# EAGLE schematic PDU_v2.1 (EAGLE 9.6.2)

## Sheet 1 of 12: PC104 Header
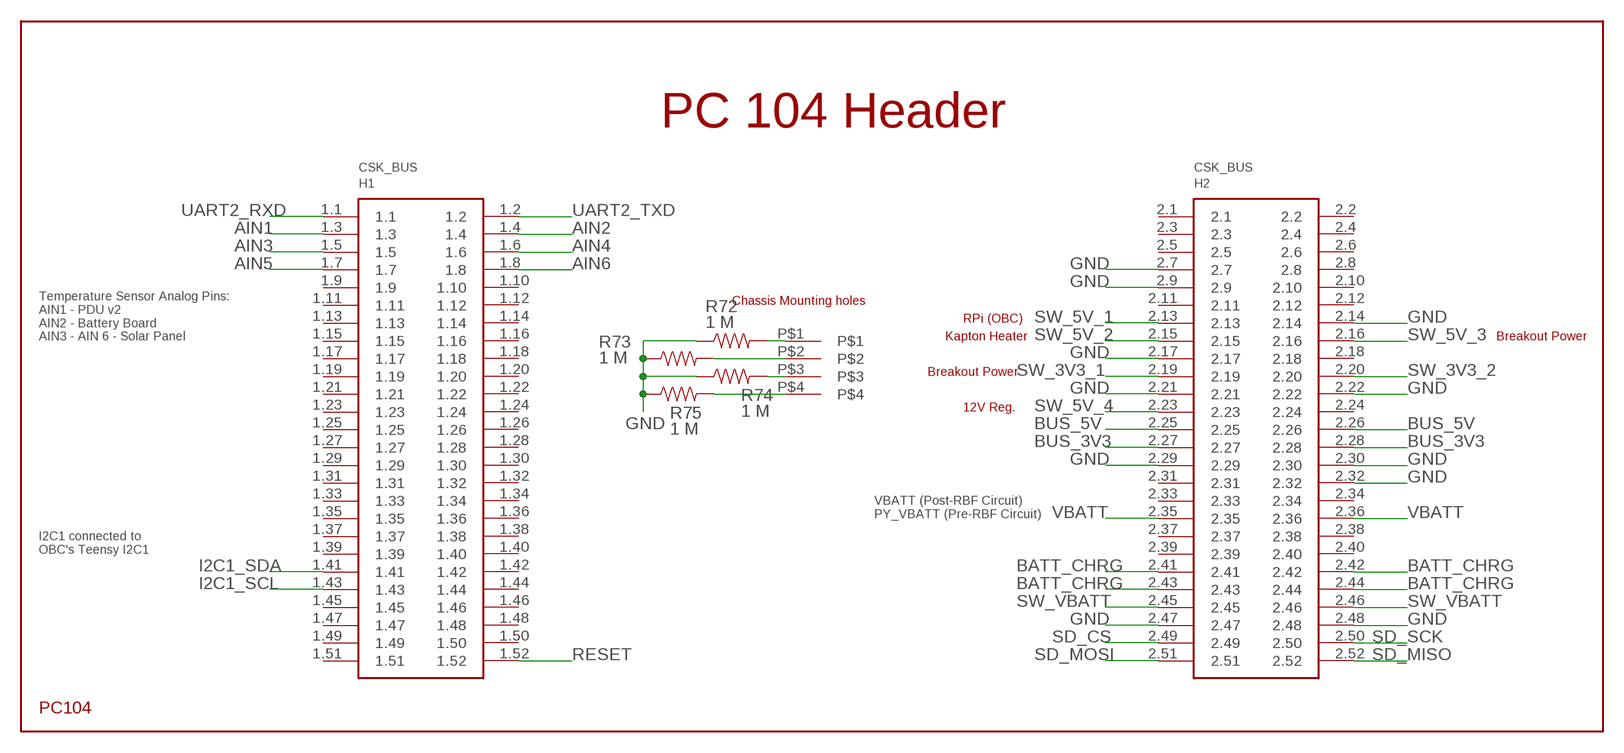
[diagram p0: schematic, sheet 1]

### Parts
H1  PC104_WCONN  [PC104_WCONN]
R72  1 M  RESISTOR0603-RES  [0603-RES]
R73  1 M  RESISTOR0603-RES  [0603-RES]
R74  1 M  RESISTOR0603-RES  [0603-RES]
R75  1 M  RESISTOR0603-RES  [0603-RES]

### Nets
AIN1: H1.1.3 ; also sheet 10
AIN2: H1.1.4 ; also sheet 2
AIN3: H1.1.5 ; also sheet 2
AIN4: H1.1.6 ; also sheet 2
AIN5: H1.1.7 ; also sheet 2
AIN6: H1.1.8 ; also sheet 2
BATT_CHRG: H1.2.41 H1.2.42 H1.2.43 H1.2.44 ; also sheet 2,11
BUS_3V3: H1.2.27 H1.2.28 ; also sheet 2,4,5,7,9,10
BUS_5V: H1.2.25 H1.2.26 ; also sheet 4,5,7,9
GND: H1.2.7 H1.2.9 H1.2.14 H1.2.17 H1.2.21 H1.2.22 H1.2.29 H1.2.30 H1.2.32 H1.2.47 H1.2.48 R72.1 R73.1 R74.1 R75.1 ; also sheet 2,3,4,5,6,7,8,9,10,11,12
I2C1_SCL: H1.1.43 ; also sheet 10
I2C1_SDA: H1.1.41 ; also sheet 10
N$59: H1.P$1 R72.2
N$64: H1.P$4 R75.2
N$67: H1.P$2 R73.2
N$71: H1.P$3 R74.2
RESET: H1.1.52 ; also sheet 2,9
SD_CS: H1.2.49 ; also sheet 2,9
SD_MISO: H1.2.52 ; also sheet 2,9
SD_MOSI: H1.2.51 ; also sheet 2,9
SD_SCK: H1.2.50 ; also sheet 2,9
SW_3V3_1: H1.2.19 ; also sheet 2,5
SW_3V3_2: H1.2.20 ; also sheet 5
SW_5V_1: H1.2.13 ; also sheet 5
SW_5V_2: H1.2.15 ; also sheet 2,5
SW_5V_3: H1.2.16 ; also sheet 2,5
SW_5V_4: H1.2.23 ; also sheet 5,6
SW_VBATT: H1.2.45 H1.2.46 ; also sheet 5
UART2_RXD: H1.1.1 ; also sheet 2,9
UART2_TXD: H1.1.2 ; also sheet 2,9
VBATT: H1.2.35 H1.2.36 ; also sheet 5,7,8,9,10,11
Unconnected: H1.1.9 H1.1.10 H1.1.11 H1.1.12 H1.1.13 H1.1.14 H1.1.15 H1.1.16 H1.1.17 H1.1.18 H1.1.19 H1.1.20 H1.1.21 H1.1.22 H1.1.23 H1.1.24 H1.1.25 H1.1.26 H1.1.27 H1.1.28 H1.1.29 H1.1.30 H1.1.31 H1.1.32 H1.1.33 H1.1.34 H1.1.35 H1.1.36 H1.1.37 H1.1.38 H1.1.39 H1.1.40 H1.1.42 H1.1.44 H1.1.45 H1.1.46 H1.1.47 H1.1.48 H1.1.49 H1.1.50 H1.1.51 H1.2.1 H1.2.2 H1.2.3 H1.2.4 H1.2.5 H1.2.6 H1.2.8 H1.2.10 H1.2.11 H1.2.12 H1.2.18 H1.2.24 H1.2.31 H1.2.33 H1.2.34 H1.2.37 H1.2.38 H1.2.39 H1.2.40

### Notes on the sheet
- PC 104 Header
- RPi (OBC)
- Temperature Sensor Analog Pins:
  AIN1 - PDU v2 
  AIN2 - Battery Board
  AIN3 - AIN 6 - Solar Panel
- Kapton Heater | Breakout Power
- Breakout Power
- 12V Reg.
- VBATT (Post-RBF Circuit)
  PY_VBATT (Pre-RBF Circuit)
- I2C1 connected to
  OBC's Teensy I2C1

## Sheet 2 of 12: Connectors
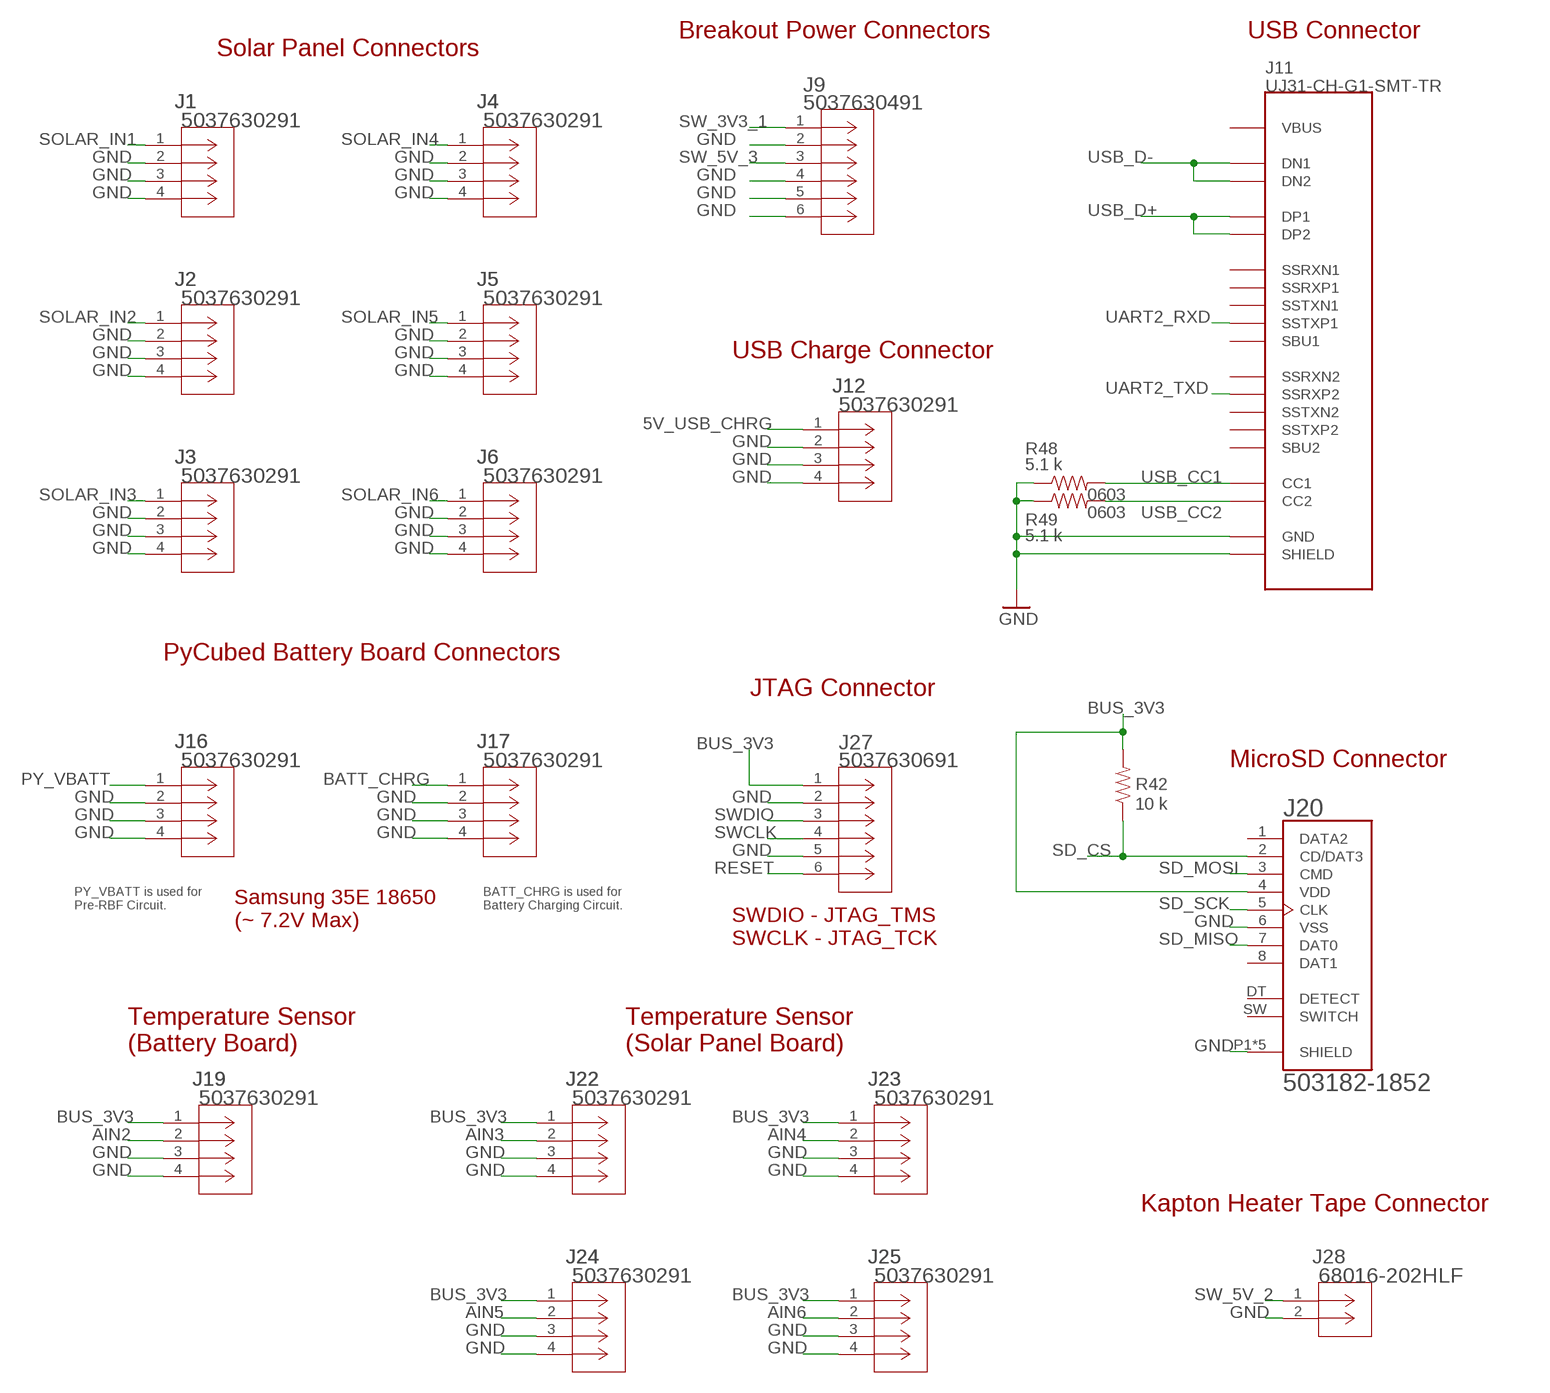
[diagram p1: schematic, sheet 2]

### Parts
J1  5037630291  [CON_5037630291]
J2  5037630291  [CON_5037630291]
J3  5037630291  [CON_5037630291]
J4  5037630291  [CON_5037630291]
J5  5037630291  [CON_5037630291]
J6  5037630291  [CON_5037630291]
J9  5037630491  [CON_5037630491]
J11  UJ31-CH-G1-SMT-TR  [CUI_UJ31-CH-G1-SMT-TR]
J12  5037630291  [CON_5037630291]
J16  5037630291  [CON_5037630291]
J17  5037630291  [CON_5037630291]
J19  5037630291  [CON_5037630291]
J20  503182-1852  [MOLEX_503182-1852]
J22  5037630291  [CON_5037630291]
J23  5037630291  [CON_5037630291]
J24  5037630291  [CON_5037630291]
J25  5037630291  [CON_5037630291]
J27  5037630691  [CONN_503763-0691_MOL]
J28  68016-202HLF  [68016-202HLF]
R42  10 k  RESISTOR0603-RES  [0603-RES]
R48  5.1 k  RESISTOR0603-RES  [0603-RES]
R49  5.1 k  RESISTOR0603-RES  [0603-RES]

### Nets
5V_USB_CHRG: J12.1 ; also sheet 11
AIN2: J19.2 ; also sheet 1
AIN3: J22.2 ; also sheet 1
AIN4: J23.2 ; also sheet 1
AIN5: J24.2 ; also sheet 1
AIN6: J25.2 ; also sheet 1
BATT_CHRG: J17.1 ; also sheet 1,11
BUS_3V3: J19.1 J20.4(VDD) J22.1 J23.1 J24.1 J25.1 J27.1 R42.2 ; also sheet 1,4,5,7,9,10
GND: J1.2 J1.3 J1.4 J2.2 J2.3 J2.4 J3.2 J3.3 J3.4 J4.2 J4.3 J4.4 J5.2 J5.3 J5.4 J6.2 J6.3 J6.4 J9.2 J9.4 J9.5 J9.6 J11.A1(GND) J11.A12(GND) J11.B1(GND) J11.B12(GND) J11.SH1(SHIELD) J11.SH2(SHIELD) J11.SH3(SHIELD) J11.SH4(SHIELD) J11.SH5(SHIELD) J11.SH6(SHIELD) J12.2 J12.3 J12.4 J16.2 J16.3 J16.4 J17.2 J17.3 J17.4 J19.3 J19.4 J20.6(VSS) J20.P1(SHIELD) J20.P2(SHIELD) J20.P3(SHIELD) J20.P4(SHIELD) J20.P5(SHIELD) J22.3 J22.4 J23.3 J23.4 J24.3 J24.4 J25.3 J25.4 J27.2 J27.5 J28.2 R48.1 R49.1 ; also sheet 1,3,4,5,6,7,8,9,10,11,12
PY_VBATT: J16.1 ; also sheet 12
RESET: J27.6 ; also sheet 1,9
SD_CS: J20.2(CD/DAT3) R42.1 ; also sheet 1,9
SD_MISO: J20.7(DAT0) ; also sheet 1,9
SD_MOSI: J20.3(CMD) ; also sheet 1,9
SD_SCK: J20.5(CLK) ; also sheet 1,9
SOLAR_IN1: J1.1 ; also sheet 10
SOLAR_IN2: J2.1 ; also sheet 10
SOLAR_IN3: J3.1 ; also sheet 10
SOLAR_IN4: J4.1 ; also sheet 10
SOLAR_IN5: J5.1
SOLAR_IN6: J6.1
SW_3V3_1: J9.1 ; also sheet 1,5
SW_5V_2: J28.1 ; also sheet 1,5
SW_5V_3: J9.3 ; also sheet 1,5
SWCLK: J27.4 ; also sheet 9
SWDIO: J27.3 ; also sheet 9
UART2_RXD: J11.A2(SSTXP1) ; also sheet 1,9
UART2_TXD: J11.A11(SSRXP2) ; also sheet 1,9
USB_CC1: J11.A5(CC1) R48.2
USB_CC2: J11.B5(CC2) R49.2
USB_D+: J11.A6(DP1) J11.B6(DP2) ; also sheet 9
USB_D-: J11.A7(DN1) J11.B7(DN2) ; also sheet 9
Unconnected: J11.A3(SSTXN1) J11.A8(SBU1) J11.A10(SSRXN2) J11.B2(SSTXP2) J11.B3(SSTXN2) J11.B8(SBU2) J11.B10(SSRXN1) J11.B11(SSRXP1) J20.1(DATA2) J20.8(DAT1) J20.DT(DETECT) J20.SW(SWITCH)

### Notes on the sheet
- Breakout Power Connectors | USB Connector
- Solar Panel Connectors
- USB Charge Connector
- 0603
- 0603
- PyCubed Battery Board Connectors
- JTAG Connector
- MicroSD Connector
- PY_VBATT is used for
  Pre-RBF Circuit.
- BATT_CHRG is used for 
  Battery Charging Circuit.
- Samsung 35E 18650
  (~ 7.2V Max)
- SWDIO - JTAG_TMS
  SWCLK - JTAG_TCK
- Temperature Sensor
  (Battery Board)
- Temperature Sensor
  (Solar Panel Board)
- Kapton Heater Tape Connector

## Sheet 3 of 12: Low Pass Filter / RC Circuit
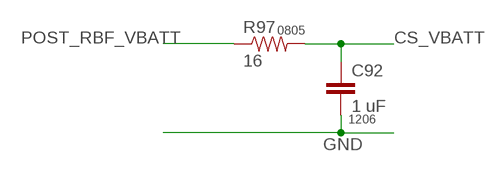
[diagram p2: schematic, sheet 3]

### Parts
C92  1 uF  CAP1206  [1206]
R97  16  RESISTOR0805-RES  [0805]

### Nets
CS_VBATT: C92.1 R97.2 ; also sheet 10
GND: C92.2 ; also sheet 1,2,4,5,6,7,8,9,10,11,12
POST_RBF_VBATT: R97.1 ; also sheet 12

### Notes on the sheet
- 0805
- 1206

## Sheet 4 of 12: H-Bridge Circuits
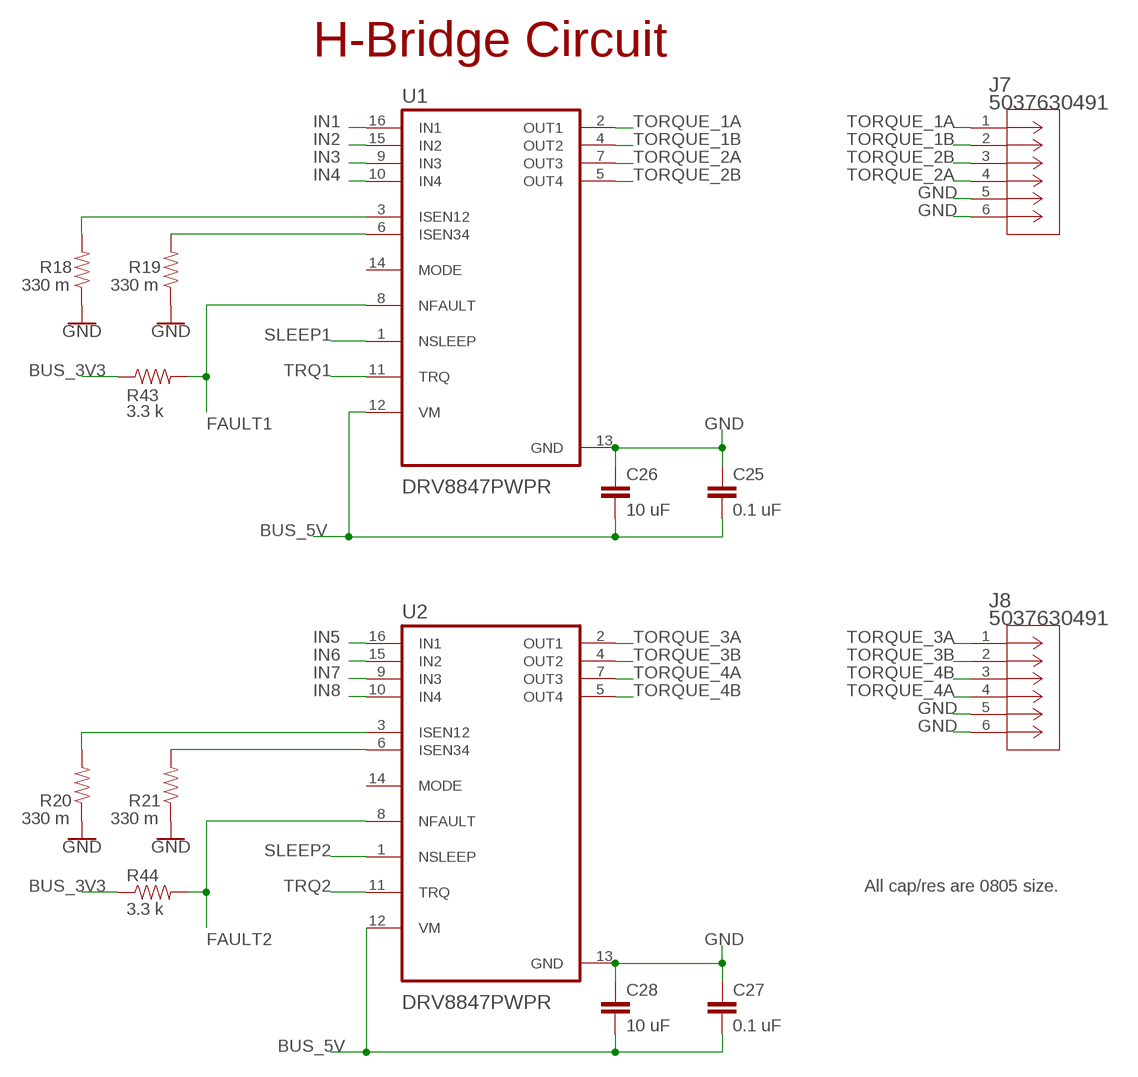
[diagram p3: schematic, sheet 4]

### Parts
C25  0.1 uF  CAP0805  [0805]
C26  10 uF  CAP0805  [0805]
C27  0.1 uF  CAP0805  [0805]
C28  10 uF  CAP0805  [0805]
J7  5037630491  [CON_5037630491]
J8  5037630491  [CON_5037630491]
R18  330 m  RESISTOR0805-RES  [0805]
R19  330 m  RESISTOR0805-RES  [0805]
R20  330 m  RESISTOR0805-RES  [0805]
R21  330 m  RESISTOR0805-RES  [0805]
R43  3.3 k  RESISTOR0805-RES  [0805]
R44  3.3 k  RESISTOR0805-RES  [0805]
U1  DRV8847PWPR  [SOP65P640X120-17N]
U2  DRV8847PWPR  [SOP65P640X120-17N]

### Nets
BUS_3V3: R43.1 R44.1 ; also sheet 1,2,5,7,9,10
BUS_5V: C25.2 C26.2 C27.2 C28.2 U1.12(VM) U2.12(VM) ; also sheet 1,5,7,9
FAULT1: R43.2 U1.8(NFAULT) ; also sheet 9
FAULT2: R44.2 U2.8(NFAULT) ; also sheet 9
GND: C25.1 C26.1 C27.1 C28.1 J7.5 J7.6 J8.5 J8.6 R18.1 R19.1 R20.1 R21.1 U1.13(GND) U2.13(GND) ; also sheet 1,2,3,5,6,7,8,9,10,11,12
IN1: U1.16(IN1) ; also sheet 9
IN2: U1.15(IN2) ; also sheet 9
IN3: U1.9(IN3) ; also sheet 9
IN4: U1.10(IN4) ; also sheet 9
IN5: U2.16(IN1) ; also sheet 9
IN6: U2.15(IN2) ; also sheet 9
IN7: U2.9(IN3) ; also sheet 9
IN8: U2.10(IN4) ; also sheet 9
N$21: R19.2 U1.6(ISEN34)
N$22: R18.2 U1.3(ISEN12)
N$23: R21.2 U2.6(ISEN34)
N$24: R20.2 U2.3(ISEN12)
SLEEP1: U1.1(NSLEEP) ; also sheet 9
SLEEP2: U2.1(NSLEEP) ; also sheet 9
TORQUE_1A: J7.1 U1.2(OUT1)
TORQUE_1B: J7.2 U1.4(OUT2)
TORQUE_2A: J7.4 U1.7(OUT3)
TORQUE_2B: J7.3 U1.5(OUT4)
TORQUE_3A: J8.1 U2.2(OUT1)
TORQUE_3B: J8.2 U2.4(OUT2)
TORQUE_4A: J8.4 U2.7(OUT3)
TORQUE_4B: J8.3 U2.5(OUT4)
TRQ1: U1.11(TRQ) ; also sheet 9
TRQ2: U2.11(TRQ) ; also sheet 9
Unconnected: U1.14(MODE) U2.14(MODE)

### Notes on the sheet
- H-Bridge Circuit
- All cap/res are 0805 size.

## Sheet 5 of 12: Switches 1
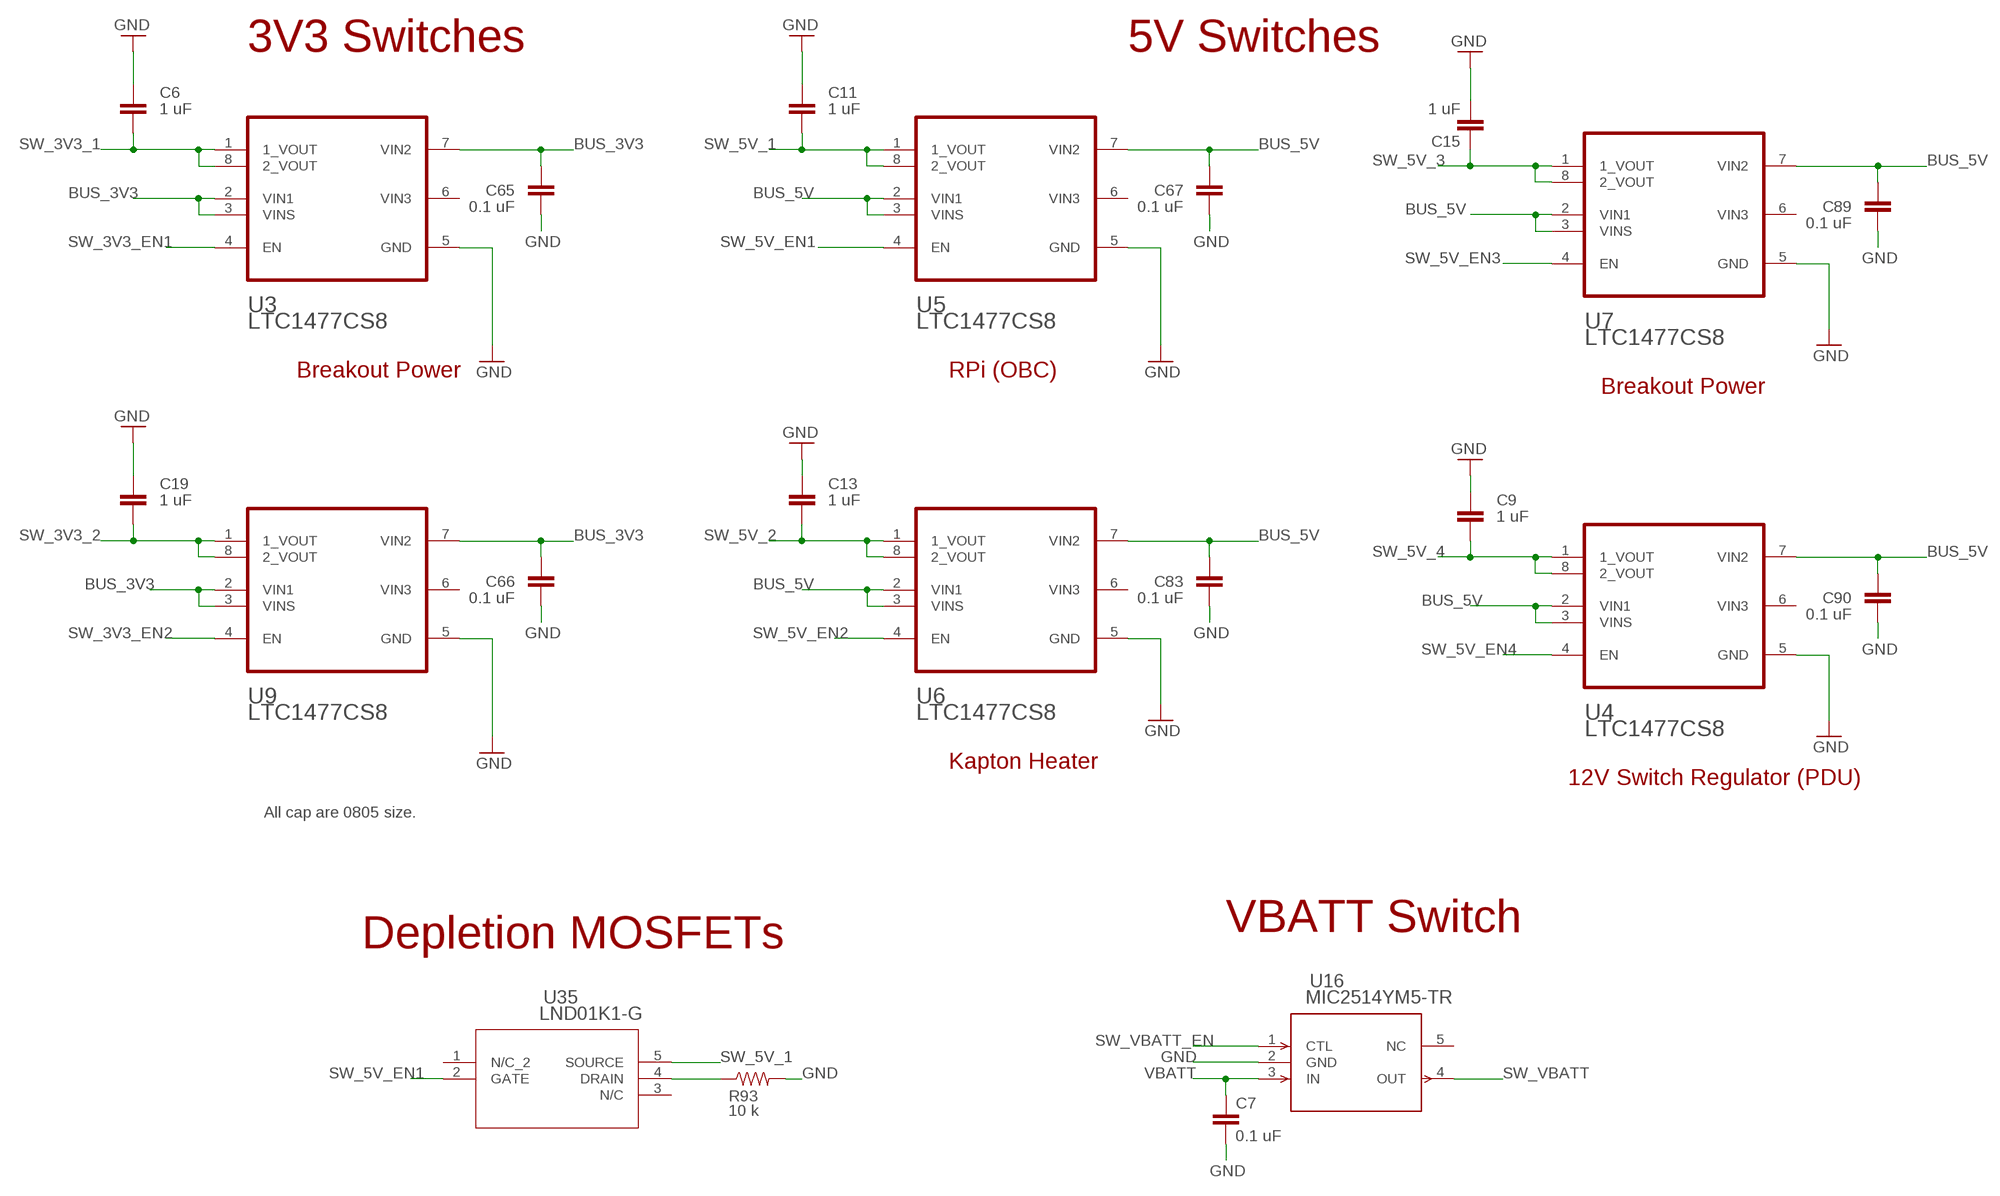
[diagram p4: schematic, sheet 5]

### Parts
C6  1 uF  CAP0805  [0805]
C7  0.1 uF  CAP0805  [0805]
C9  1 uF  CAP0805  [0805]
C11  1 uF  CAP0805  [0805]
C13  1 uF  CAP0805  [0805]
C15  1 uF  CAP0805  [0805]
C19  1 uF  CAP0805  [0805]
C65  0.1 uF  CAP0805  [0805]
C66  0.1 uF  CAP0805  [0805]
C67  0.1 uF  CAP0805  [0805]
C83  0.1 uF  CAP0805  [0805]
C89  0.1 uF  CAP0805  [0805]
C90  0.1 uF  CAP0805  [0805]
R93  10 k  RESISTOR0805-RES  [0805]
U3  LTC1477CS8LINEAR_TECHNOLOGY_LTC1477CS8_0_2  [LINEAR_TECHNOLOGY_LTC1477CS8_2]
U4  LTC1477CS8LINEAR_TECHNOLOGY_LTC1477CS8_0_2  [LINEAR_TECHNOLOGY_LTC1477CS8_2]
U5  LTC1477CS8LINEAR_TECHNOLOGY_LTC1477CS8_0_2  [LINEAR_TECHNOLOGY_LTC1477CS8_2]
U6  LTC1477CS8LINEAR_TECHNOLOGY_LTC1477CS8_0_2  [LINEAR_TECHNOLOGY_LTC1477CS8_2]
U7  LTC1477CS8LINEAR_TECHNOLOGY_LTC1477CS8_0_2  [LINEAR_TECHNOLOGY_LTC1477CS8_2]
U9  LTC1477CS8LINEAR_TECHNOLOGY_LTC1477CS8_0_2  [LINEAR_TECHNOLOGY_LTC1477CS8_2]
U16  MIC2514YM5-TR  [SOT-23-5_M5_MCH]
U35  LND01K1-G  [SOT-23-5_MC_MCH]

### Nets
BUS_3V3: C65.1 C66.1 U3.2(VIN1) U3.3(VINS) U3.7(VIN2) U9.2(VIN1) U9.3(VINS) U9.7(VIN2) ; also sheet 1,2,4,7,9,10
BUS_5V: C67.1 C83.1 C89.1 C90.1 U4.2(VIN1) U4.3(VINS) U4.7(VIN2) U5.2(VIN1) U5.3(VINS) U5.7(VIN2) U6.2(VIN1) U6.3(VINS) U6.7(VIN2) U7.2(VIN1) U7.3(VINS) U7.7(VIN2) ; also sheet 1,4,7,9
GND: C6.2 C7.2 C9.2 C11.2 C13.2 C15.2 C19.2 C65.2 C66.2 C67.2 C83.2 C89.2 C90.2 R93.2 U3.5(GND) U4.5(GND) U5.5(GND) U6.5(GND) U7.5(GND) U9.5(GND) U16.2(GND) ; also sheet 1,2,3,4,6,7,8,9,10,11,12
N$60: R93.1 U35.4(DRAIN)
SW_3V3_1: C6.1 U3.1(1_VOUT) U3.8(2_VOUT) ; also sheet 1,2
SW_3V3_2: C19.1 U9.1(1_VOUT) U9.8(2_VOUT) ; also sheet 1
SW_3V3_EN1: U3.4(EN) ; also sheet 9
SW_3V3_EN2: U9.4(EN) ; also sheet 9
SW_5V_1: C11.1 U5.1(1_VOUT) U5.8(2_VOUT) U35.5(SOURCE) ; also sheet 1
SW_5V_2: C13.1 U6.1(1_VOUT) U6.8(2_VOUT) ; also sheet 1,2
SW_5V_3: C15.1 U7.1(1_VOUT) U7.8(2_VOUT) ; also sheet 1,2
SW_5V_4: C9.1 U4.1(1_VOUT) U4.8(2_VOUT) ; also sheet 1,6
SW_5V_EN1: U5.4(EN) U35.2(GATE) ; also sheet 9
SW_5V_EN2: U6.4(EN) ; also sheet 9
SW_5V_EN3: U7.4(EN) ; also sheet 9
SW_5V_EN4: U4.4(EN) ; also sheet 9
SW_VBATT: U16.4(OUT) ; also sheet 1
SW_VBATT_EN: U16.1(CTL) ; also sheet 9
VBATT: C7.1 U16.3(IN) ; also sheet 1,7,8,9,10,11
Unconnected: U16.5(NC) U35.1(N/C_2) U35.3(N/C)

### Notes on the sheet
- 3V3 Switches | 5V Switches
- Breakout Power | RPi (OBC)
- Breakout Power
- Kapton Heater
- 12V Switch Regulator (PDU)
- All cap are 0805 size.
- VBATT Switch
- Depletion MOSFETs
- Switches (3V3, 5V, VBATT)

## Sheet 6 of 12: Switches 2
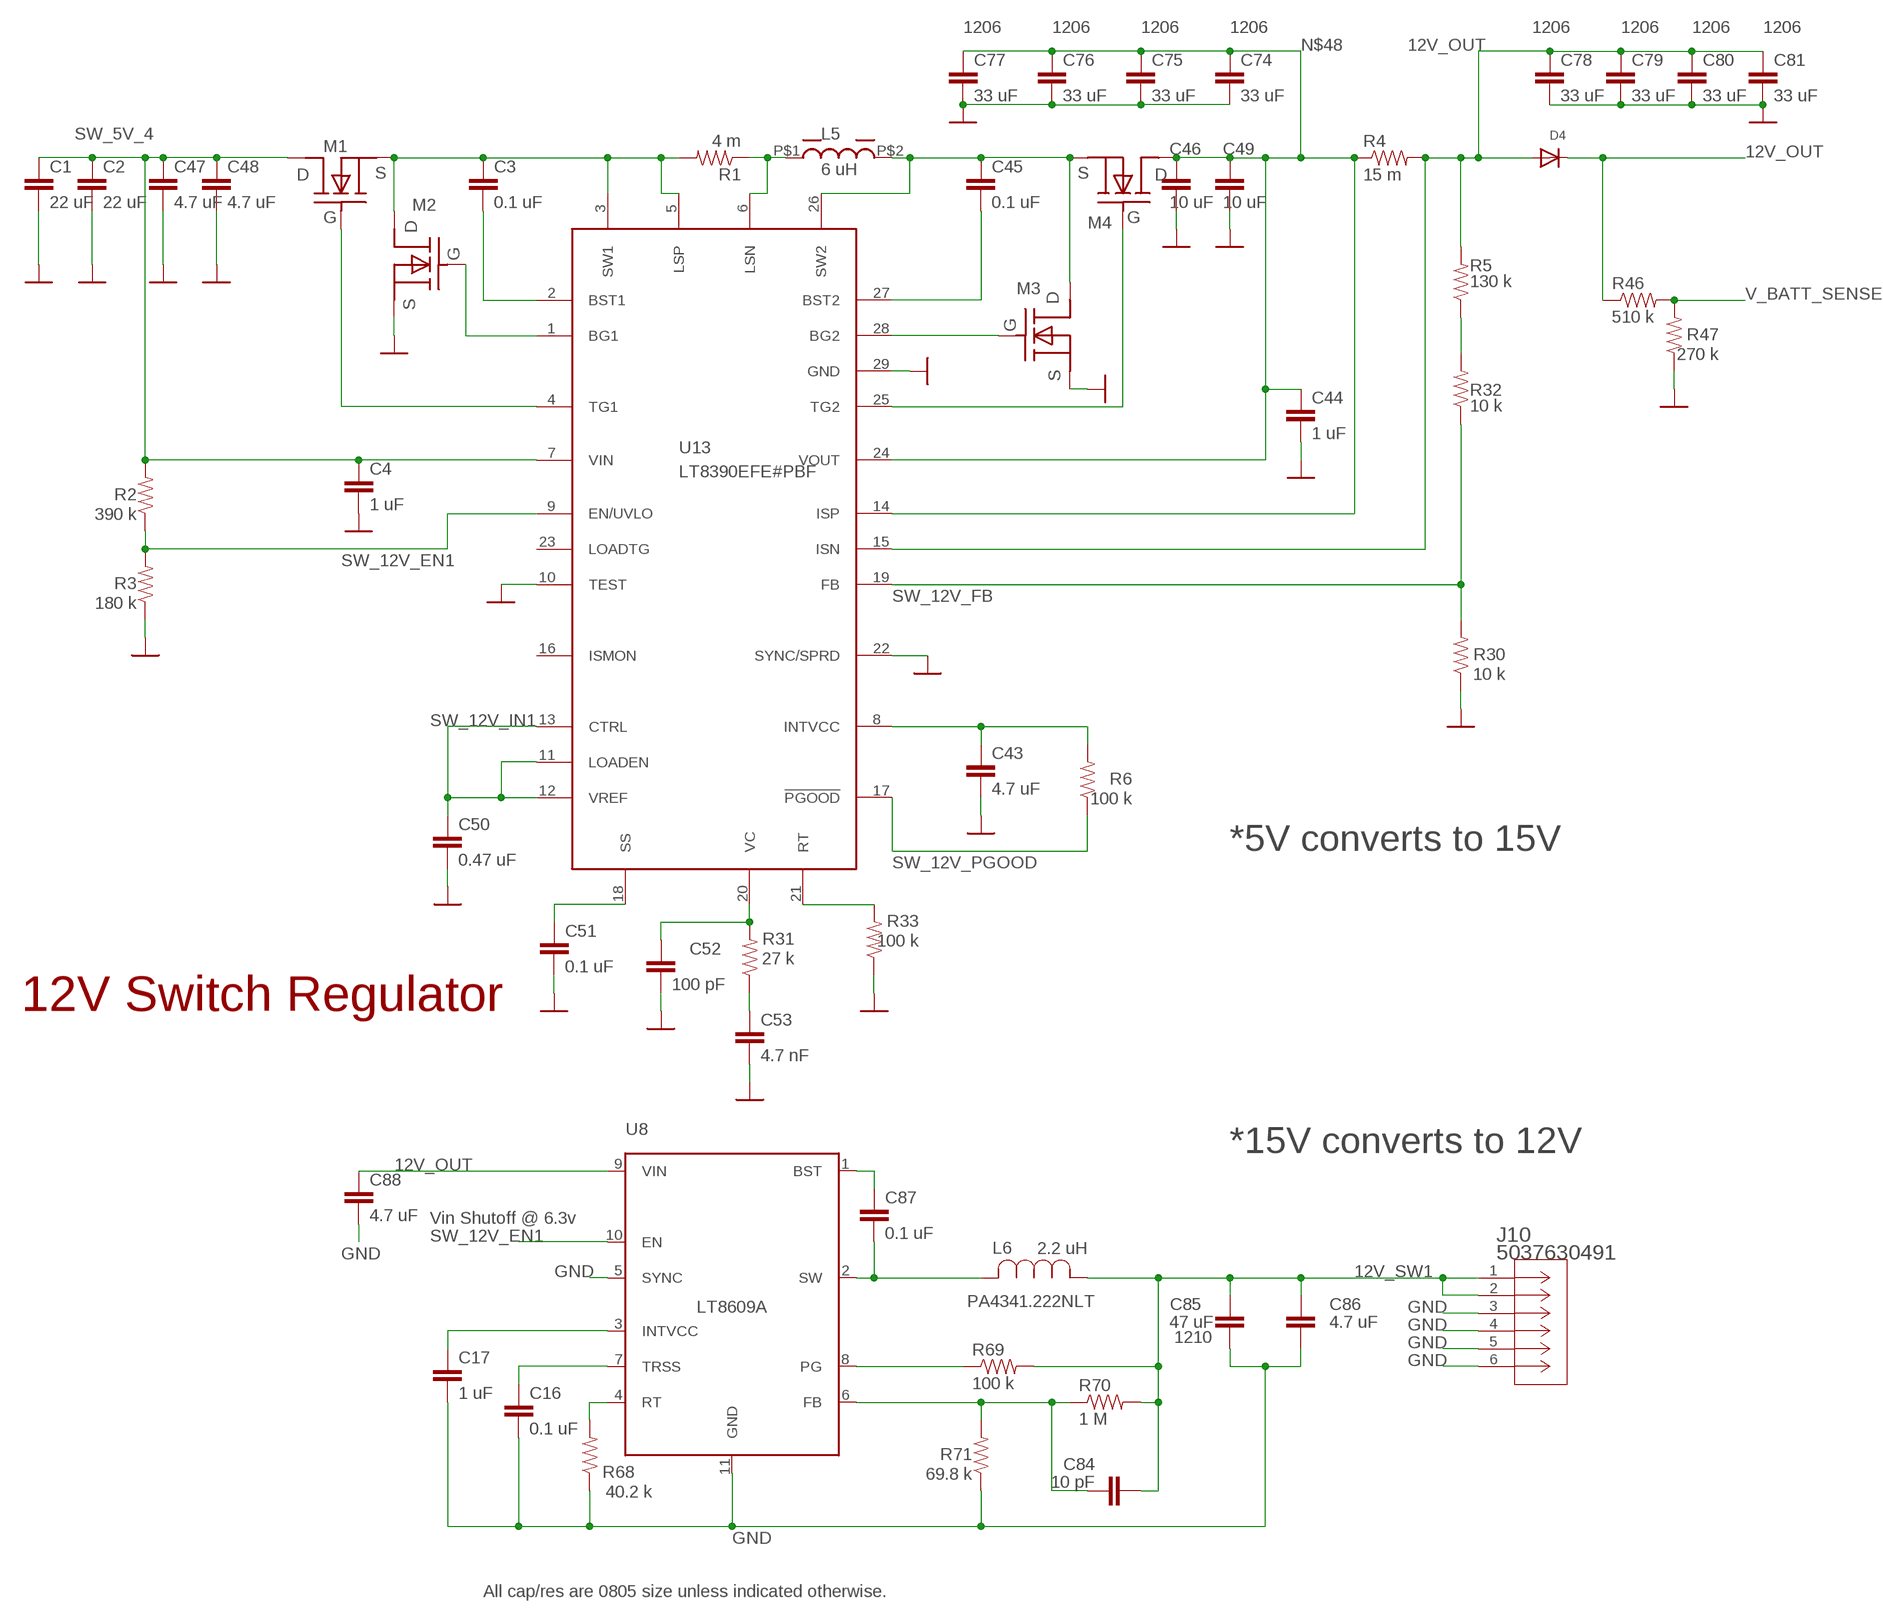
[diagram p5: schematic, sheet 6]

### Parts
C1  22 uF  CAP0805  [0805]
C2  22 uF  CAP0805  [0805]
C3  0.1 uF  CAP0805  [0805]
C4  1 uF  CAP0805  [0805]
C16  0.1 uF  CAP0805  [0805]
C17  1 uF  CAP0805  [0805]
C43  4.7 uF  CAP0805  [0805]
C44  1 uF  CAP0805  [0805]
C45  0.1 uF  CAP0805  [0805]
C46  10 uF  CAP0805  [0805]
C47  4.7 uF  CAP0805  [0805]
C48  4.7 uF  CAP0805  [0805]
C49  10 uF  CAP0805  [0805]
C50  0.47 uF  CAP0805  [0805]
C51  0.1 uF  CAP0805  [0805]
C52  100 pF  CAP0805  [0805]
C53  4.7 nF  CAP0805  [0805]
C74  33 uF  CAP1206  [1206]
C75  33 uF  CAP1206  [1206]
C76  33 uF  CAP1206  [1206]
C77  33 uF  CAP1206  [1206]
C78  33 uF  CAP1206  [1206]
C79  33 uF  CAP1206  [1206]
C80  33 uF  CAP1206  [1206]
C81  33 uF  CAP1206  [1206]
C84  10 pF  CAP0805  [0805]
C85  47 uF  CAP1210  [1210]
C86  4.7 uF  CAP0805  [0805]
C87  0.1 uF  CAP0805  [0805]
C88  4.7 uF  CAP0805  [0805]
D4  DIODE_SOD-123FL  [SOD-123FL]
J10  5037630491  [CON_5037630491]
L5  6 uH  7443551600  [7443551600]
L6  PA4341.222NLT  [IND_222NLT_PUL]
M1  BSZ100N06LS3  [BSZ100N06LS3]
M2  BSZ100N06LS3  [BSZ100N06LS3]
M3  BSZ033NE2LS5  BSZ100N06LS3  [BSZ100N06LS3]
M4  BSZ033NE2LS5  BSZ100N06LS3  [BSZ100N06LS3]
R1  4 m  RESISTOR0805-RES  [0805]
R2  390 k  RESISTOR0805-RES  [0805]
R3  180 k  RESISTOR0805-RES  [0805]
R4  15 m  RESISTOR0805-RES  [0805]
R5  130 k  RESISTOR0805-RES  [0805]
R6  100 k  RESISTOR0805-RES  [0805]
R30  10 k  RESISTOR0805-RES  [0805]
R31  27 k  RESISTOR0805-RES  [0805]
R32  10 k  RESISTOR0805-RES  [0805]
R33  100 k  RESISTOR0805-RES  [0805]
R46  510 k  RESISTOR0805-RES  [0805]
R47  270 k  RESISTOR0805-RES  [0805]
R68  40.2 k  RESISTOR0805-RES  [0805]
R69  100 k  RESISTOR0805-RES  [0805]
R70  1 M  RESISTOR0805-RES  [0805]
R71  69.8 k  RESISTOR0805-RES  [0805]
U8  LT8609A  [MSOP-10_MSE]
U13  LT8390EFE#PBF  [SOP65P640X120-29N]

### Nets
12V_OUT: C78.1 C79.1 C80.1 C81.1 C88.1 D4.A D4.C R4.2 R5.2 R46.1 U8.9(VIN) U13.15(ISN)
12V_SW1: C84.2 C85.1 C86.1 J10.1 J10.2 L6.1 R69.2 R70.2
BST_3V3_BUS: C87.1 U8.1(BST)
FB_3V3_BUS: C84.1 R70.1 R71.2 U8.6(FB)
GND: C1.2 C2.2 C4.2 C16.2 C17.2 C43.2 C44.2 C46.2 C47.2 C48.2 C49.2 C50.2 C51.2 C52.2 C53.2 C74.2 C75.2 C76.2 C77.2 C78.2 C79.2 C80.2 C81.2 C85.2 C86.2 C88.2 J10.3 J10.4 J10.5 J10.6 M2.P$2(S) M2.P$3(S) M2.P$4(S) M3.P$2(S) M3.P$3(S) M3.P$4(S) R3.1 R30.1 R33.1 R47.1 R68.1 R71.1 U8.5(SYNC) U8.11(GND) U13.10(TEST) U13.22(SYNC/SPRD) U13.29(GND) ; also sheet 1,2,3,4,5,7,8,9,10,11,12
N$1: C3.1 M1.P$2(S) M1.P$3(S) M1.P$4(S) M2.P$5(D) M2.P$6(D) M2.P$7(D) M2.P$8(D) M2.P$9(D) R1.2 U13.3(SW1) U13.5(LSP)
N$2: C3.2 U13.2(BST1)
N$3: M2.P$1(G) U13.1(BG1)
N$4: M1.P$1(G) U13.4(TG1)
N$6: M3.P$1(G) U13.28(BG2)
N$38: C52.1 R31.2 U13.20(VC)
N$40: R5.1 R32.2
N$41: C45.1 L5.P$2 M3.P$5(D) M3.P$6(D) M3.P$7(D) M3.P$8(D) M3.P$9(D) M4.P$2(S) M4.P$3(S) M4.P$4(S) U13.26(SW2)
N$44: C43.1 R6.2 U13.8(INTVCC)
N$45: L5.P$1 R1.1 U13.6(LSN)
N$47: C45.2 U13.27(BST2)
N$48: C44.1 C46.1 C49.1 C74.1 C75.1 C76.1 C77.1 M4.P$5(D) M4.P$6(D) M4.P$7(D) M4.P$8(D) M4.P$9(D) R4.1 U13.14(ISP) U13.24(VOUT)
N$49: M4.P$1(G) U13.25(TG2)
N$50: C51.1 U13.18(SS)
N$52: R33.2 U13.21(RT)
N$55: C53.1 R31.1
PG_3V3_BUS: R69.1 U8.8(PG)
RT_3V3_BUS: R68.2 U8.4(RT)
SW_3V3_BUS: C87.2 L6.2 U8.2(SW)
SW_5V_4: C1.1 C2.1 C4.1 C47.1 C48.1 M1.P$5(D) M1.P$6(D) M1.P$7(D) M1.P$8(D) M1.P$9(D) R2.2 U13.7(VIN) ; also sheet 1,5
SW_12V_EN1: R2.1 R3.2 U8.10(EN) U13.9(EN/UVLO)
SW_12V_FB: R30.2 R32.1 U13.19(FB)
SW_12V_IN1: C50.1 U13.11(LOADEN) U13.12(VREF) U13.13(CTRL)
SW_12V_PGOOD: R6.1 U13.17(!PGOOD)
TRSS_3V3_BUS: C16.1 U8.7(TRSS)
V_BATT_SENSE: R46.2 R47.2
VCC_3V3_BUS: C17.1 U8.3(INTVCC)
Unconnected: U13.16(ISMON) U13.23(LOADTG)

### Notes on the sheet
- 1206 | 1206 | 1206 | 1206 | 1206 | 1206 | 1206 | 1206
- 6 uH
- *5V converts to 15V
- 12V Switch Regulator
- *15V converts to 12V
- Vin Shutoff @ 6.3v
- 2.2 uH
- 1210
- All cap/res are 0805 size unless indicated otherwise.

## Sheet 7 of 12: Bus (3V3, 5V)
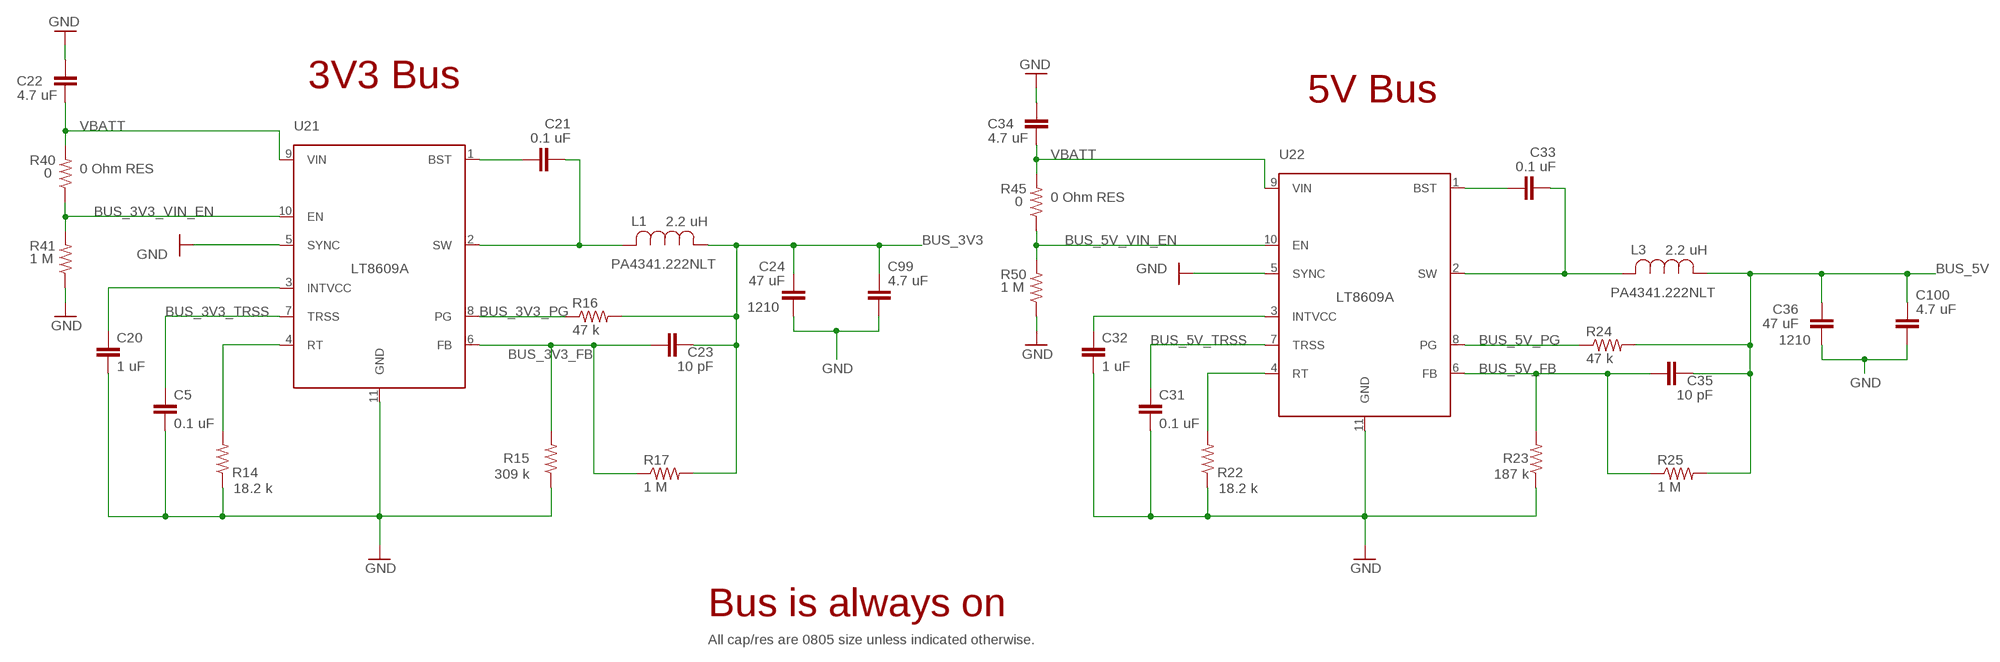
[diagram p6: schematic, sheet 7]

### Parts
C5  0.1 uF  CAP0805  [0805]
C20  1 uF  CAP0805  [0805]
C21  0.1 uF  CAP0805  [0805]
C22  4.7 uF  CAP0805  [0805]
C23  10 pF  CAP0805  [0805]
C24  47 uF  CAP1210  [1210]
C31  0.1 uF  CAP0805  [0805]
C32  1 uF  CAP0805  [0805]
C33  0.1 uF  CAP0805  [0805]
C34  4.7 uF  CAP0805  [0805]
C35  10 pF  CAP0805  [0805]
C36  47 uF  CAP1210  [1210]
C99  4.7 uF  CAP0805  [0805]
C100  4.7 uF  CAP0805  [0805]
L1  PA4341.222NLT  [IND_222NLT_PUL]
L3  PA4341.222NLT  [IND_222NLT_PUL]
R14  18.2 k  RESISTOR0805-RES  [0805]
R15  309 k  RESISTOR0805-RES  [0805]
R16  47 k  RESISTOR0805-RES  [0805]
R17  1 M  RESISTOR0805-RES  [0805]
R22  18.2 k  RESISTOR0805-RES  [0805]
R23  187 k  RESISTOR0805-RES  [0805]
R24  47 k  RESISTOR0805-RES  [0805]
R25  1 M  RESISTOR0805-RES  [0805]
R40  0  RESISTOR0805-RES  [0805]
R41  1 M  RESISTOR0805-RES  [0805]
R45  0  RESISTOR0805-RES  [0805]
R50  1 M  RESISTOR0805-RES  [0805]
U21  LT8609A  [MSOP-10_MSE]
U22  LT8609A  [MSOP-10_MSE]

### Nets
BUS_3V3: C23.2 C24.1 C99.1 L1.1 R16.2 R17.2 ; also sheet 1,2,4,5,9,10
BUS_3V3_FB: C23.1 R15.2 R17.1 U21.6(FB)
BUS_3V3_PG: R16.1 U21.8(PG)
BUS_3V3_TRSS: C5.1 U21.7(TRSS)
BUS_3V3_VIN_EN: R40.1 R41.2 U21.10(EN)
BUS_5V: C35.2 C36.1 C100.1 L3.1 R24.2 R25.2 ; also sheet 1,4,5,9
BUS_5V_FB: C35.1 R23.2 R25.1 U22.6(FB)
BUS_5V_PG: R24.1 U22.8(PG)
BUS_5V_TRSS: C31.1 U22.7(TRSS)
BUS_5V_VIN_EN: R45.1 R50.2 U22.10(EN)
GND: C5.2 C20.2 C22.2 C24.2 C31.2 C32.2 C34.2 C36.2 C99.2 C100.2 R14.1 R15.1 R22.1 R23.1 R41.1 R50.1 U21.5(SYNC) U21.11(GND) U22.5(SYNC) U22.11(GND) ; also sheet 1,2,3,4,5,6,8,9,10,11,12
N$7: C20.1 U21.3(INTVCC)
N$8: R14.2 U21.4(RT)
N$11: C21.1 U21.1(BST)
N$12: C21.2 L1.2 U21.2(SW)
N$25: R22.2 U22.4(RT)
N$27: C32.1 U22.3(INTVCC)
N$28: C33.1 U22.1(BST)
N$29: C33.2 L3.2 U22.2(SW)
VBATT: C22.1 C34.1 R40.2 R45.2 U21.9(VIN) U22.9(VIN) ; also sheet 1,5,8,9,10,11

### Notes on the sheet
- 3V3 Bus
- 5V Bus
- 0 Ohm RES
- 0 Ohm RES
- 2.2 uH
- 2.2 uH
- 1210
- 1210
- Bus is always on
- All cap/res are 0805 size unless indicated otherwise.

## Sheet 8 of 12: 5V Burn
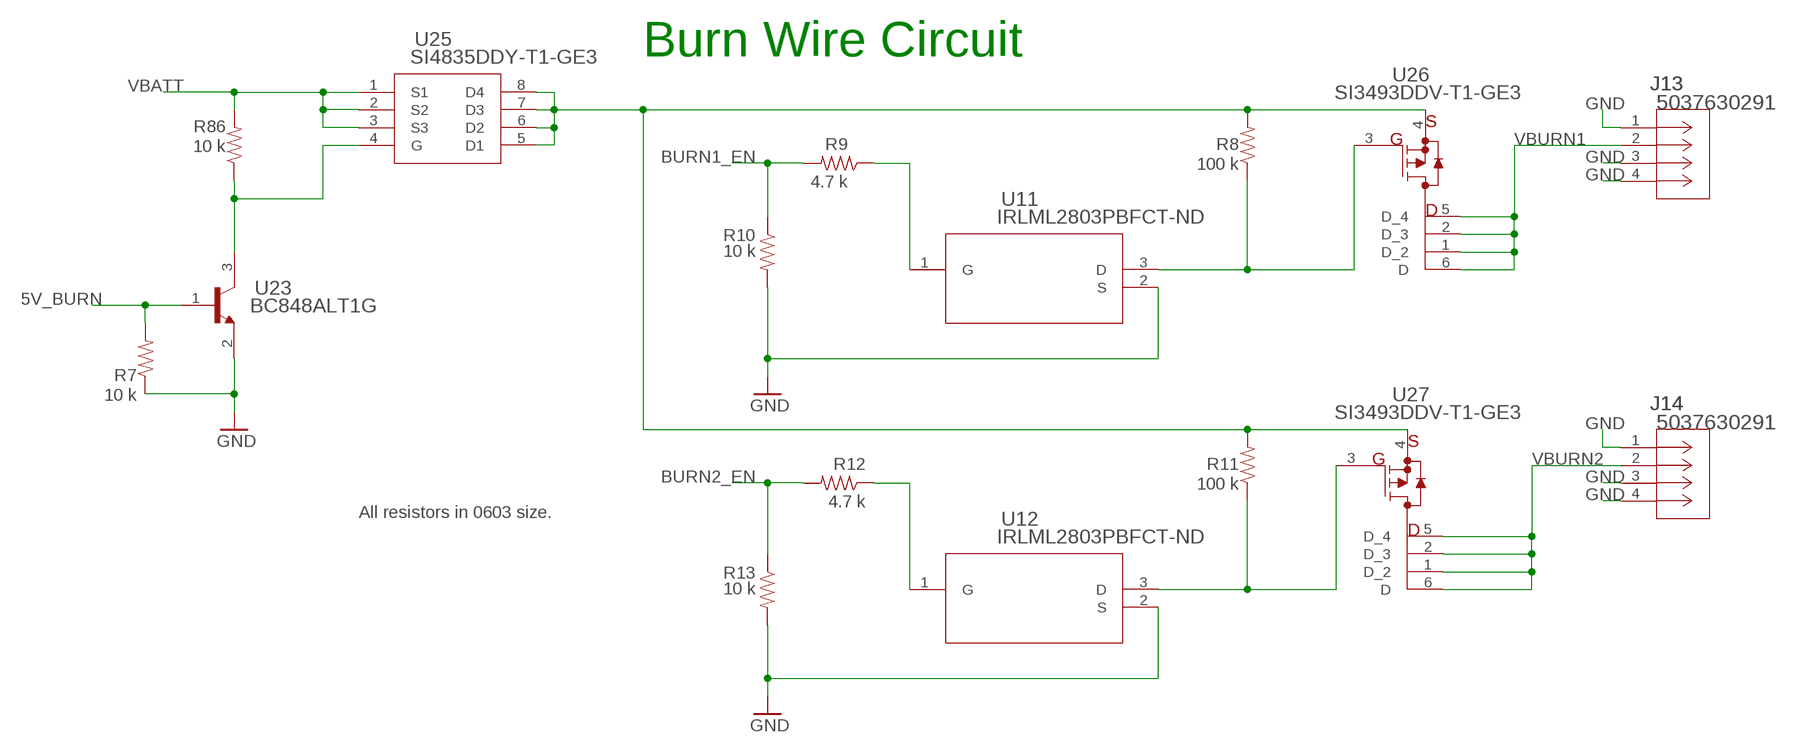
[diagram p7: schematic, sheet 8]

### Parts
J13  5037630291  [CON_5037630291]
J14  5037630291  [CON_5037630291]
R7  10 k  RESISTOR0603-RES  [0603-RES]
R8  100 k  RESISTOR0603-RES  [0603-RES]
R9  4.7 k  RESISTOR0603-RES  [0603-RES]
R10  10 k  RESISTOR0603-RES  [0603-RES]
R11  100 k  RESISTOR0603-RES  [0603-RES]
R12  4.7 k  RESISTOR0603-RES  [0603-RES]
R13  10 k  RESISTOR0603-RES  [0603-RES]
R86  10 k  RESISTOR0603-RES  [0603-RES]
U11  IRLML2803PBFCT-ND  [PG-TO23-3_INF]
U12  IRLML2803PBFCT-ND  [PG-TO23-3_INF]
U23  BC848ALT1G  [SOT-23_ONS]
U25  SI4835DDY-T1-GE3  [SOIC_DY-T1-GE3_VIS]
U26  SI3493DDV-T1-GE3  [6TSOP_VIS]
U27  SI3493DDV-T1-GE3  [6TSOP_VIS]

### Nets
5V_BURN: R7.2 U23.1(BASE) ; also sheet 9
BURN1_EN: R9.2 R10.1 ; also sheet 9
BURN2_EN: R12.2 R13.1 ; also sheet 9
GND: J13.1 J13.3 J13.4 J14.1 J14.3 J14.4 R7.1 R10.2 R13.2 U11.2(S) U12.2(S) U23.2(EMITTER) ; also sheet 1,2,3,4,5,6,7,9,10,11,12
N$13: R8.2 R11.2 U25.5(D1) U25.6(D2) U25.7(D3) U25.8(D4) U26.4(S) U27.4(S)
N$14: R12.1 U12.1(G)
N$15: R11.1 U12.3(D) U27.3(G)
N$16: R86.1 U23.3(COLLECTOR) U25.4(G)
N$17: R9.1 U11.1(G)
N$18: R8.1 U11.3(D) U26.3(G)
VBATT: R86.2 U25.1(S1) U25.2(S2) U25.3(S3) ; also sheet 1,5,7,9,10,11
VBURN1: J13.2 U26.1(D_2) U26.2(D_3) U26.5(D_4) U26.6(D)
VBURN2: J14.2 U27.1(D_2) U27.2(D_3) U27.5(D_4) U27.6(D)

### Notes on the sheet
- Burn Wire Circuit
- All resistors in 0603 size.

## Sheet 9 of 12: Microprocessor
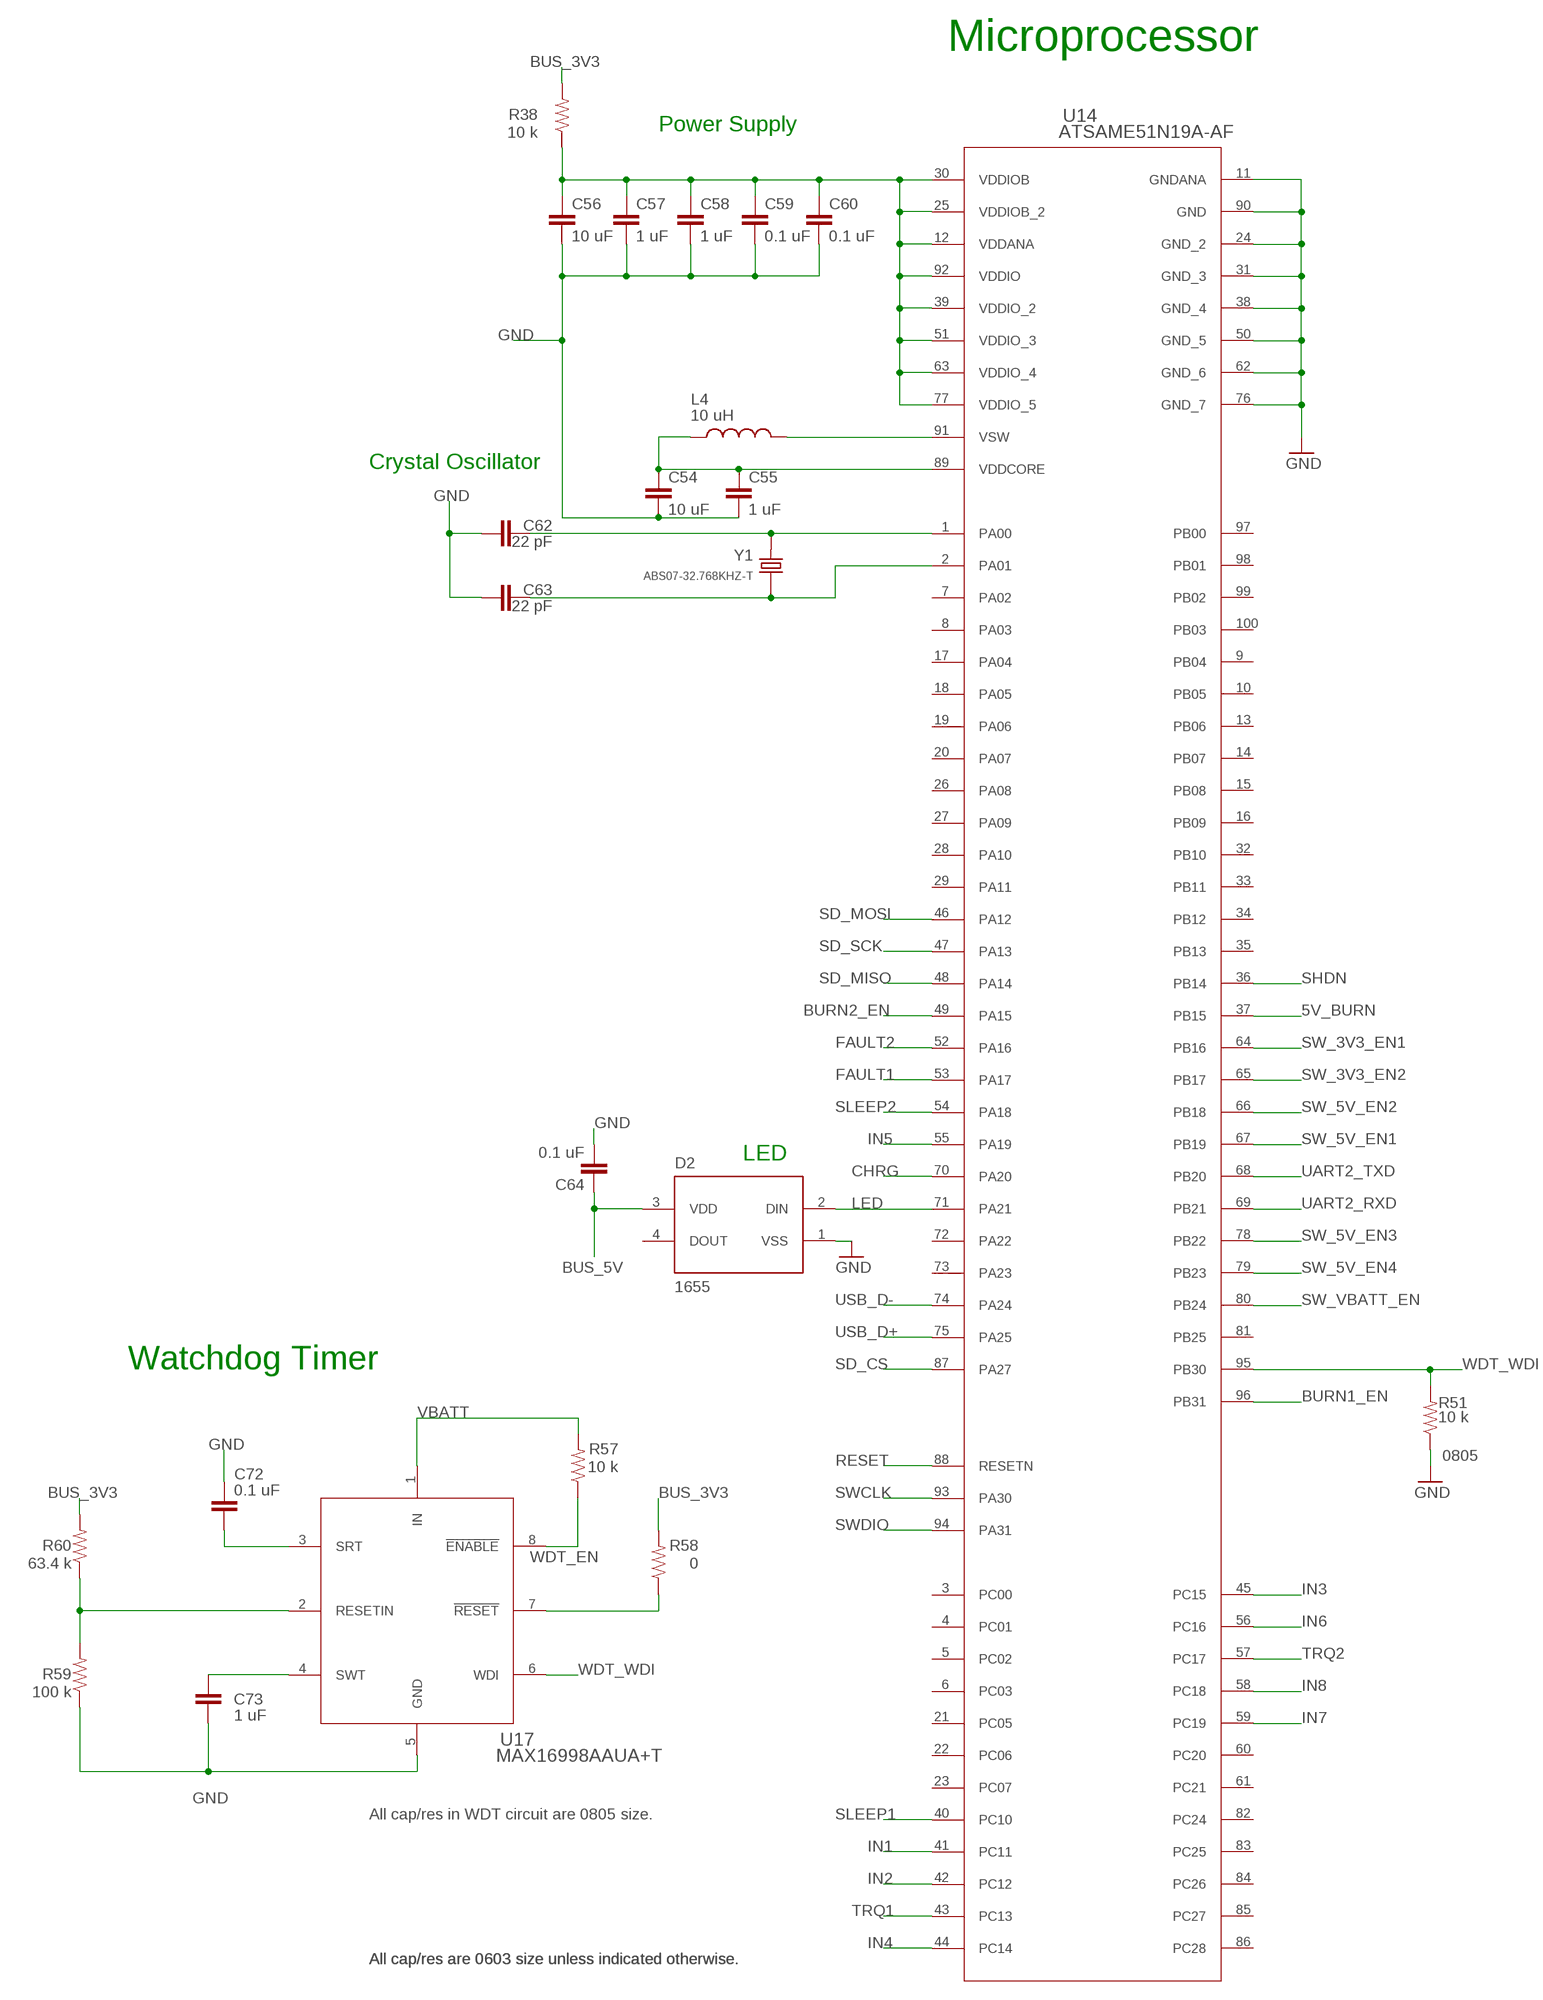
[diagram p8: schematic, sheet 9]

### Parts
C54  10 uF  CAP0603-CAP  [0603-CAP]
C55  1 uF  CAP0603-CAP  [0603-CAP]
C56  10 uF  CAP0603-CAP  [0603-CAP]
C57  1 uF  CAP0603-CAP  [0603-CAP]
C58  1 uF  CAP0603-CAP  [0603-CAP]
C59  0.1 uF  CAP0603-CAP  [0603-CAP]
C60  0.1 uF  CAP0603-CAP  [0603-CAP]
C62  22 pF  CAP0603-CAP  [0603-CAP]
C63  22 pF  CAP0603-CAP  [0603-CAP]
C64  0.1 uF  CAP0603-CAP  [0603-CAP]
C72  0.1 uF  CAP0805  [0805]
C73  1 uF  CAP0805  [0805]
D2  1655  [LED_1655]
L4  10 uH  CBL2012T100M  [INDC2012X100N]
R38  10 k  RESISTOR0603-RES  [0603-RES]
R51  10 k  RESISTOR0805-RES  [0805]
R57  10 k  RESISTOR0805-RES  [0805]
R58  0  RESISTOR0805-RES  [0805]
R59  100 k  RESISTOR0805-RES  [0805]
R60  63.4 k  RESISTOR0805-RES  [0805]
U14  ATSAME51N19A-AF  [TQFP100_14X14MC_MCH]
U17  MAX16998AAUA+T  [21-0036K_MXM]
Y1  ABS07-32.768KHZ-T  [XTAL_ABS07-32.768KHZ-T]

### Nets
5V_BURN: U14.37(PB15) ; also sheet 8
BURN1_EN: U14.96(PB31) ; also sheet 8
BURN2_EN: U14.49(PA15) ; also sheet 8
BUS_3V3: R38.2 R58.2 R60.2 ; also sheet 1,2,4,5,7,10
BUS_5V: C64.1 D2.3(VDD) ; also sheet 1,4,5,7
CCO_0: C62.2 U14.1(PA00) Y1.2
CCO_1: C63.2 U14.2(PA01) Y1.1
CHRG: U14.70(PA20) ; also sheet 11
FAULT1: U14.53(PA17) ; also sheet 4
FAULT2: U14.52(PA16) ; also sheet 4
GND: C54.2 C55.2 C56.2 C57.2 C58.2 C59.2 C60.2 C62.1 C63.1 C64.2 C72.1 C73.2 D2.1(VSS) R51.1 R59.1 U14.11(GNDANA) U14.24(GND_2) U14.31(GND_3) U14.38(GND_4) U14.50(GND_5) U14.62(GND_6) U14.76(GND_7) U14.90(GND) U17.5(GND) ; also sheet 1,2,3,4,5,6,7,8,10,11,12
IN1: U14.41(PC11) ; also sheet 4
IN2: U14.42(PC12) ; also sheet 4
IN3: U14.45(PC15) ; also sheet 4
IN4: U14.44(PC14) ; also sheet 4
IN5: U14.55(PA19) ; also sheet 4
IN6: U14.56(PC16) ; also sheet 4
IN7: U14.59(PC19) ; also sheet 4
IN8: U14.58(PC18) ; also sheet 4
LED: D2.2(DIN) U14.71(PA21)
N$46: L4.2 U14.91(VSW)
N$58: C54.1 C55.1 L4.1 U14.89(VDDCORE)
N$66: C72.2 U17.3(SRT)
N$68: C73.1 U17.4(SWT)
N$70: R59.2 R60.1 U17.2(RESETIN)
RESET: R58.1 U14.88(RESETN) U17.7(!RESET) ; also sheet 1,2
SD_CS: U14.87(PA27) ; also sheet 1,2
SD_MISO: U14.48(PA14) ; also sheet 1,2
SD_MOSI: U14.46(PA12) ; also sheet 1,2
SD_SCK: U14.47(PA13) ; also sheet 1,2
SHDN: U14.36(PB14) ; also sheet 11
SLEEP1: U14.40(PC10) ; also sheet 4
SLEEP2: U14.54(PA18) ; also sheet 4
SW_3V3_EN1: U14.64(PB16) ; also sheet 5
SW_3V3_EN2: U14.65(PB17) ; also sheet 5
SW_5V_EN1: U14.67(PB19) ; also sheet 5
SW_5V_EN2: U14.66(PB18) ; also sheet 5
SW_5V_EN3: U14.78(PB22) ; also sheet 5
SW_5V_EN4: U14.79(PB23) ; also sheet 5
SW_VBATT_EN: U14.80(PB24) ; also sheet 5
SWCLK: U14.93(PA30) ; also sheet 2
SWDIO: U14.94(PA31) ; also sheet 2
TRQ1: U14.43(PC13) ; also sheet 4
TRQ2: U14.57(PC17) ; also sheet 4
UART2_RXD: U14.69(PB21) ; also sheet 1,2
UART2_TXD: U14.68(PB20) ; also sheet 1,2
USB_D+: U14.75(PA25) ; also sheet 2
USB_D-: U14.74(PA24) ; also sheet 2
VBATT: R57.2 U17.1(IN) ; also sheet 1,5,7,8,10,11
VDD: C56.1 C57.1 C58.1 C59.1 C60.1 R38.1 U14.12(VDDANA) U14.25(VDDIOB_2) U14.30(VDDIOB) U14.39(VDDIO_2) U14.51(VDDIO_3) U14.63(VDDIO_4) U14.77(VDDIO_5) U14.92(VDDIO)
WDT_EN: R57.1 U17.8(!ENABLE)
WDT_WDI: R51.2 U14.95(PB30) U17.6(WDI)
Unconnected: D2.4(DOUT) U14.3(PC00) U14.4(PC01) U14.5(PC02) U14.6(PC03) U14.7(PA02) U14.8(PA03) U14.9(PB04) U14.10(PB05) U14.13(PB06) U14.14(PB07) U14.15(PB08) U14.16(PB09) U14.17(PA04) U14.18(PA05) U14.19(PA06) U14.20(PA07) U14.21(PC05) U14.22(PC06) U14.23(PC07) U14.26(PA08) U14.27(PA09) U14.28(PA10) U14.29(PA11) U14.32(PB10) U14.33(PB11) U14.34(PB12) U14.35(PB13) U14.60(PC20) U14.61(PC21) U14.72(PA22) U14.73(PA23) U14.81(PB25) U14.82(PC24) U14.83(PC25) U14.84(PC26) U14.85(PC27) U14.86(PC28) U14.97(PB00) U14.98(PB01) U14.99(PB02) U14.100(PB03)

### Notes on the sheet
- Microprocessor
- Power Supply
- Crystal Oscillator
- LED
- Watchdog Timer
- 0805
- All cap/res in WDT circuit are 0805 size.
- All cap/res are 0603 size unless indicated otherwise. | All cap/res are 0603 size unless indicated otherwise.

## Sheet 10 of 12: Sensors (Current, Temperature)
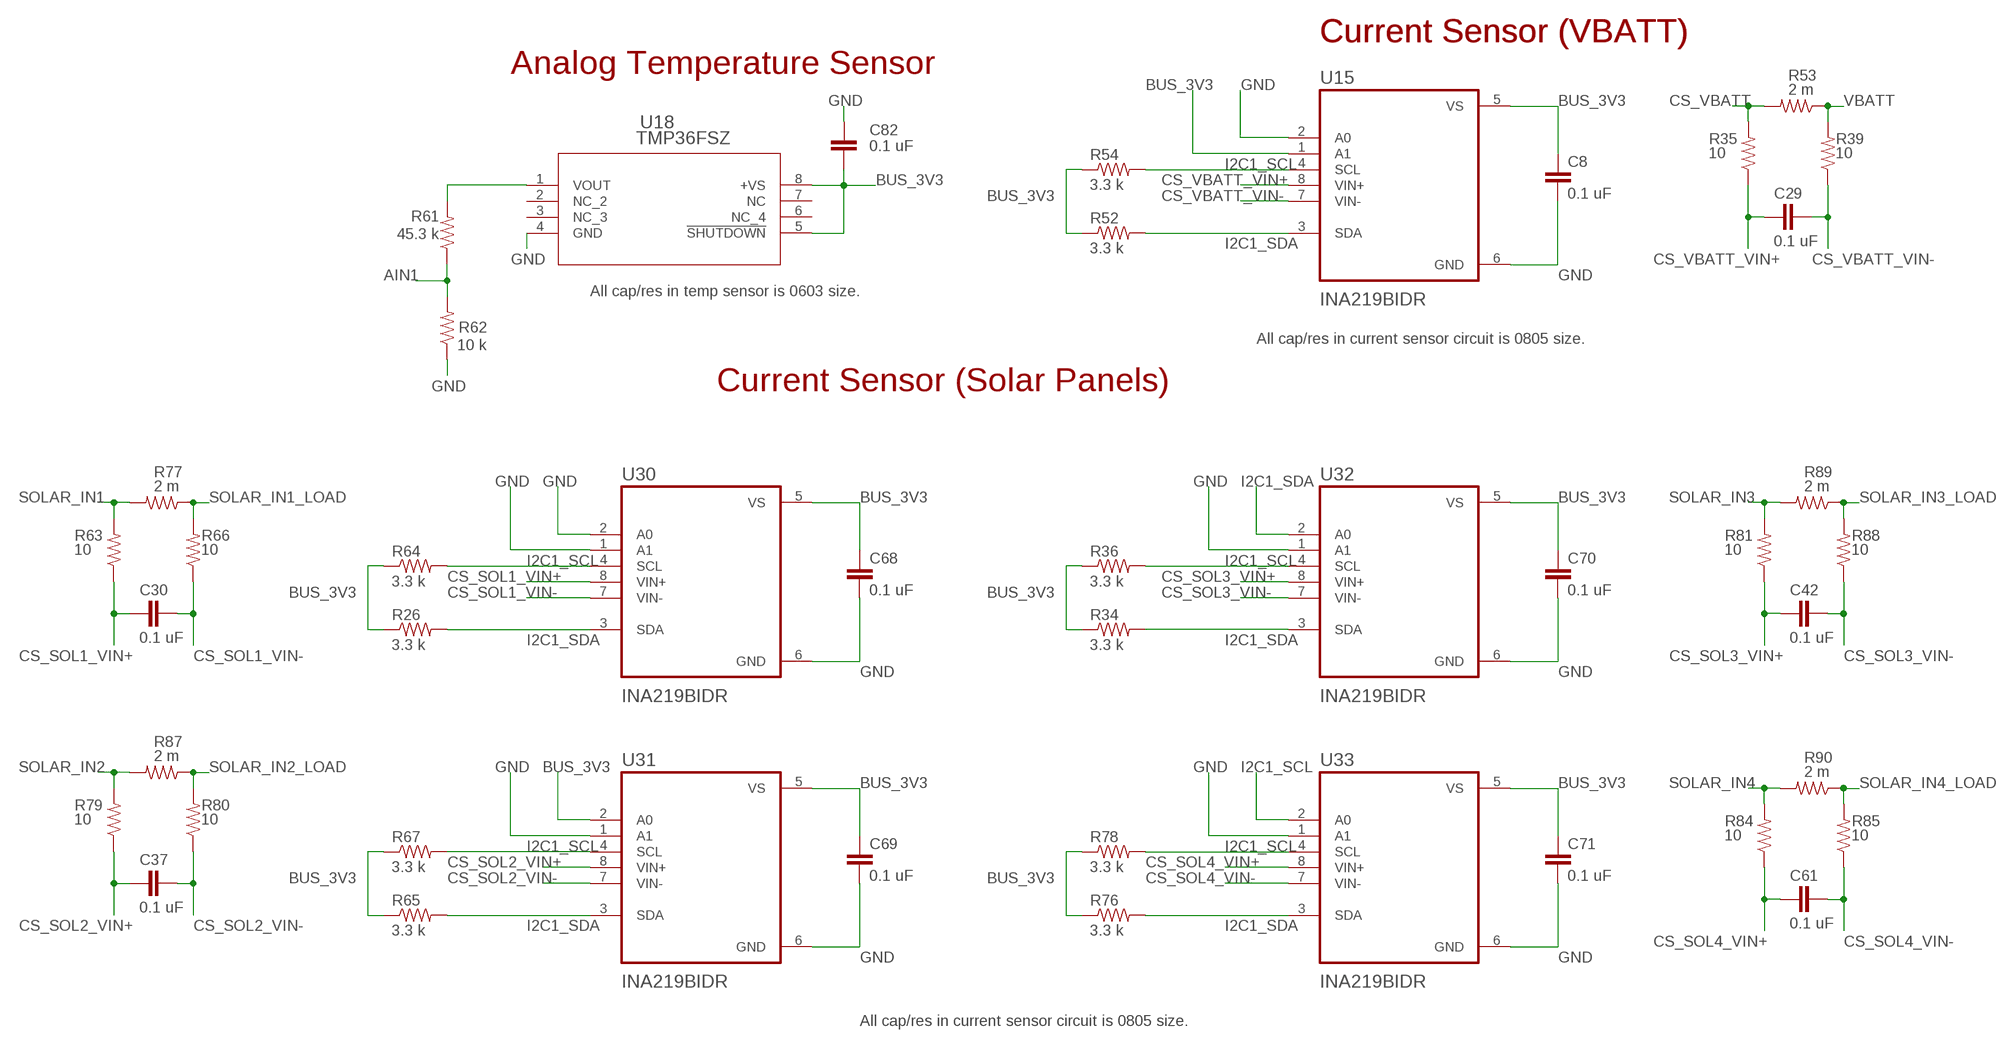
[diagram p9: schematic, sheet 10]

### Parts
C8  0.1 uF  CAP0805  [0805]
C29  0.1 uF  CAP0805  [0805]
C30  0.1 uF  CAP0805  [0805]
C37  0.1 uF  CAP0805  [0805]
C42  0.1 uF  CAP0805  [0805]
C61  0.1 uF  CAP0805  [0805]
C68  0.1 uF  CAP0805  [0805]
C69  0.1 uF  CAP0805  [0805]
C70  0.1 uF  CAP0805  [0805]
C71  0.1 uF  CAP0805  [0805]
C82  0.1 uF  CAP0603-CAP  [0603-CAP]
R26  3.3 k  RESISTOR0805-RES  [0805]
R34  3.3 k  RESISTOR0805-RES  [0805]
R35  10  RESISTOR0805-RES  [0805]
R36  3.3 k  RESISTOR0805-RES  [0805]
R39  10  RESISTOR0805-RES  [0805]
R52  3.3 k  RESISTOR0805-RES  [0805]
R53  2 m  RESISTOR0805-RES  [0805]
R54  3.3 k  RESISTOR0805-RES  [0805]
R61  45.3 k  RESISTOR0603-RES  [0603-RES]
R62  10 k  RESISTOR0603-RES  [0603-RES]
R63  10  RESISTOR0805-RES  [0805]
R64  3.3 k  RESISTOR0805-RES  [0805]
R65  3.3 k  RESISTOR0805-RES  [0805]
R66  10  RESISTOR0805-RES  [0805]
R67  3.3 k  RESISTOR0805-RES  [0805]
R76  3.3 k  RESISTOR0805-RES  [0805]
R77  2 m  RESISTOR0805-RES  [0805]
R78  3.3 k  RESISTOR0805-RES  [0805]
R79  10  RESISTOR0805-RES  [0805]
R80  10  RESISTOR0805-RES  [0805]
R81  10  RESISTOR0805-RES  [0805]
R84  10  RESISTOR0805-RES  [0805]
R85  10  RESISTOR0805-RES  [0805]
R87  2 m  RESISTOR0805-RES  [0805]
R88  10  RESISTOR0805-RES  [0805]
R89  2 m  RESISTOR0805-RES  [0805]
R90  2 m  RESISTOR0805-RES  [0805]
U15  INA219BIDR  [SOIC127P599X175-8N]
U18  TMP36FSZ  [R_8_ADI]
U30  INA219BIDR  [SOIC127P599X175-8N]
U31  INA219BIDR  [SOIC127P599X175-8N]
U32  INA219BIDR  [SOIC127P599X175-8N]
U33  INA219BIDR  [SOIC127P599X175-8N]

### Nets
AIN1: R61.1 R62.2 ; also sheet 1
BUS_3V3: C8.1 C68.1 C69.1 C70.1 C71.1 C82.2 R26.1 R34.1 R36.1 R52.1 R54.1 R64.1 R65.1 R67.1 R76.1 R78.1 U15.1(A1) U15.5(VS) U18.5(!SHUTDOWN) U18.8(+VS) U30.5(VS) U31.2(A0) U31.5(VS) U32.5(VS) U33.5(VS) ; also sheet 1,2,4,5,7,9
CS_SOL1_VIN+: C30.1 R63.1 U30.8(VIN+)
CS_SOL1_VIN-: C30.2 R66.1 U30.7(VIN-)
CS_SOL2_VIN+: C37.1 R79.1 U31.8(VIN+)
CS_SOL2_VIN-: C37.2 R80.1 U31.7(VIN-)
CS_SOL3_VIN+: C42.1 R81.1 U32.8(VIN+)
CS_SOL3_VIN-: C42.2 R88.1 U32.7(VIN-)
CS_SOL4_VIN+: C61.1 R84.1 U33.8(VIN+)
CS_SOL4_VIN-: C61.2 R85.1 U33.7(VIN-)
CS_VBATT: R35.2 R53.2 ; also sheet 3
CS_VBATT_VIN+: C29.1 R35.1 U15.8(VIN+)
CS_VBATT_VIN-: C29.2 R39.1 U15.7(VIN-)
GND: C8.2 C68.2 C69.2 C70.2 C71.2 C82.1 R62.1 U15.2(A0) U15.6(GND) U18.4(GND) U30.1(A1) U30.2(A0) U30.6(GND) U31.1(A1) U31.6(GND) U32.1(A1) U32.6(GND) U33.1(A1) U33.6(GND) ; also sheet 1,2,3,4,5,6,7,8,9,11,12
I2C1_SCL: R36.2 R54.2 R64.2 R67.2 R78.2 U15.4(SCL) U30.4(SCL) U31.4(SCL) U32.4(SCL) U33.2(A0) U33.4(SCL) ; also sheet 1
I2C1_SDA: R26.2 R34.2 R52.2 R65.2 R76.2 U15.3(SDA) U30.3(SDA) U31.3(SDA) U32.2(A0) U32.3(SDA) U33.3(SDA) ; also sheet 1
N$42: R61.2 U18.1(VOUT)
SOLAR_IN1: R63.2 R77.2 ; also sheet 2
SOLAR_IN1_LOAD: R66.2 R77.1 ; also sheet 11
SOLAR_IN2: R79.2 R87.2 ; also sheet 2
SOLAR_IN2_LOAD: R80.2 R87.1 ; also sheet 11
SOLAR_IN3: R81.2 R89.2 ; also sheet 2
SOLAR_IN3_LOAD: R88.2 R89.1 ; also sheet 11
SOLAR_IN4: R84.2 R90.2 ; also sheet 2
SOLAR_IN4_LOAD: R85.2 R90.1 ; also sheet 11
VBATT: R39.2 R53.1 ; also sheet 1,5,7,8,9,11
Unconnected: U18.2(NC_2) U18.3(NC_3) U18.6(NC_4) U18.7(NC)

### Notes on the sheet
- Current Sensor (VBATT) | Current Sensor (VBATT)
- Analog Temperature Sensor
- All cap/res in temp sensor is 0603 size.
- All cap/res in current sensor circuit is 0805 size.
- Current Sensor (Solar Panels)
- All cap/res in current sensor circuit is 0805 size.

## Sheet 11 of 12: Battery Charging
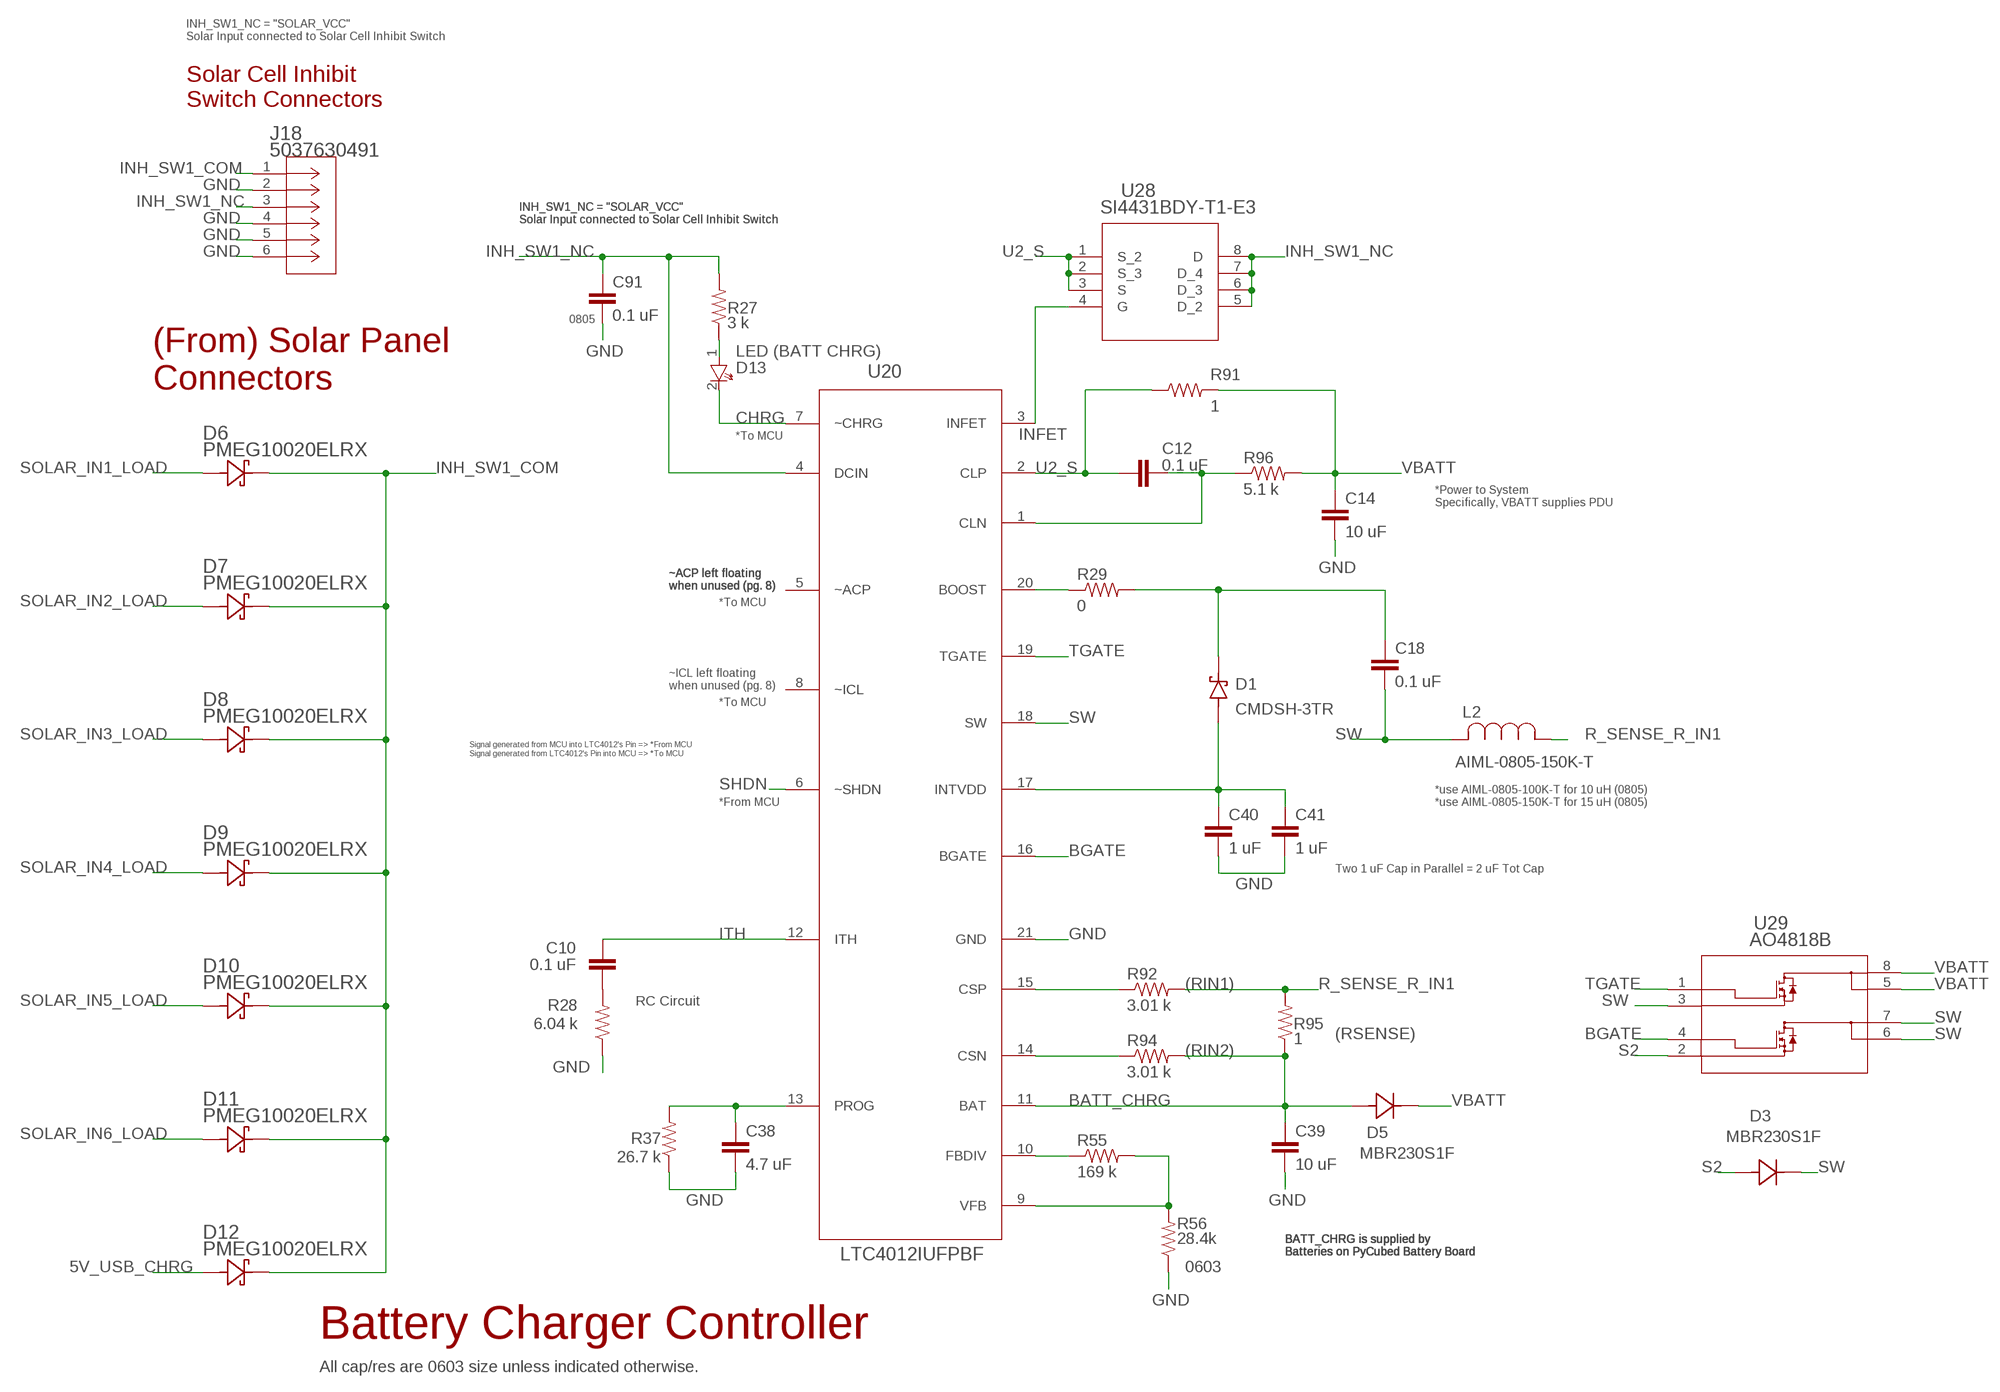
[diagram p10: schematic, sheet 11]

### Parts
C10  0.1 uF  CAP0805  [0805]
C12  0.1 uF  CAP0805  [0805]
C14  10 uF  CAP0805  [0805]
C18  0.1 uF  CAP0805  [0805]
C38  4.7 uF  CAP0805  [0805]
C39  10 uF  CAP0805  [0805]
C40  1 uF  CAP0805  [0805]
C41  1 uF  CAP0805  [0805]
C91  0.1 uF  CAP0805  [0805]
D1  CMDSH-3TR  [SOD2512X110N]
D3  MBR230S1F  [CR_0LSFT1G_ONS]
D5  MBR230S1F  [CR_0LSFT1G_ONS]
D6  PMEG10020ELRX  [CFP3_SOD123W_NEX]
D7  PMEG10020ELRX  [CFP3_SOD123W_NEX]
D8  PMEG10020ELRX  [CFP3_SOD123W_NEX]
D9  PMEG10020ELRX  [CFP3_SOD123W_NEX]
D10  PMEG10020ELRX  [CFP3_SOD123W_NEX]
D11  PMEG10020ELRX  [CFP3_SOD123W_NEX]
D12  PMEG10020ELRX  [CFP3_SOD123W_NEX]
D13  LED_0805  [LED_0805]
J18  5037630491  [CON_5037630491]
L2  AIML-0805-150K-T  [AIML-0805_ABR]
R27  3 k  RESISTOR0805-RES  [0805]
R28  6.04 k  RESISTOR0805-RES  [0805]
R29  0  RESISTOR0805-RES  [0805]
R37  26.7 k  RESISTOR0805-RES  [0805]
R55  169 k  RESISTOR0805-RES  [0805]
R56  28.4k  RESISTOR0603-RES  [0603-RES]
R91  1  RESISTOR0805-RES  [0805]
R92  3.01 k  RESISTOR0805-RES  [0805]
R94  3.01 k  RESISTOR0805-RES  [0805]
R95  1  RESISTOR0805-RES  [0805]
R96  5.1 k  RESISTOR0805-RES  [0805]
U20  LTC4012IUFPBF  [QFN50P400X400X80-21N]
U28  SI4431BDY-T1-E3  [SOIC-8_SI]
U29  AO4818B  [SOIC8_NARROW_VIS]

### Nets
5V_USB_CHRG: D12.2 ; also sheet 2
BATT_CHRG: C39.1 D5.1 R94.2 R95.1 U20.11(BAT) ; also sheet 1,2
BGATE: U20.16(BGATE) U29.4
CHRG: D13.2 U20.7(~CHRG) ; also sheet 9
GND: C14.2 C38.2 C39.2 C40.2 C41.2 C91.2 J18.2 J18.4 J18.5 J18.6 R28.1 R37.1 R56.1 U20.21(GND) ; also sheet 1,2,3,4,5,6,7,8,9,10,12
INFET: U20.3(INFET) U28.4(G)
INH_SW1_COM: D6.1 D7.1 D8.1 D9.1 D10.1 D11.1 D12.1 J18.1
INH_SW1_NC: C91.1 J18.3 R27.2 U20.4(DCIN) U28.5(D_2) U28.6(D_3) U28.7(D_4) U28.8(D)
ITH: C10.1 U20.12(ITH)
N$26: D13.1 R27.1
N$30: C10.2 R28.2
N$31: C12.2 R96.1 U20.1(CLN)
N$33: R29.1 U20.20(BOOST)
N$37: C40.1 C41.1 D1.A U20.17(INTVDD)
N$39: C18.1 D1.C R29.2
N$43: R92.1 U20.15(CSP)
N$51: R94.1 U20.14(CSN)
N$53: C38.1 R37.2 U20.13(PROG)
N$54: R55.1 U20.10(FBDIV)
N$56: R55.2 R56.2 U20.9(VFB)
R_SENSE_R_IN1: L2.1 R92.2 R95.2
S2: D3.1 U29.2
SHDN: U20.6(~SHDN) ; also sheet 9
SOLAR_IN1_LOAD: D6.2 ; also sheet 10
SOLAR_IN2_LOAD: D7.2 ; also sheet 10
SOLAR_IN3_LOAD: D8.2 ; also sheet 10
SOLAR_IN4_LOAD: D9.2 ; also sheet 10
SOLAR_IN5_LOAD: D10.2
SOLAR_IN6_LOAD: D11.2
SW: C18.2 D3.2 L2.2 U20.18(SW) U29.3 U29.6 U29.7
TGATE: U20.19(TGATE) U29.1
U2_S: C12.1 R91.1 U20.2(CLP) U28.1(S_2) U28.2(S_3) U28.3(S)
VBATT: C14.1 D5.2 R91.2 R96.2 U29.5 U29.8 ; also sheet 1,5,7,8,9,10
Unconnected: U20.5(~ACP) U20.8(~ICL)

### Notes on the sheet
- INH_SW1_NC = "SOLAR_VCC"
  Solar Input connected to Solar Cell Inhibit Switch
- Solar Cell Inhibit
  Switch Connectors
- INH_SW1_NC = "SOLAR_VCC"
  Solar Input connected to Solar Cell Inhibit Switch
- INH_SW1_NC = "SOLAR_VCC"
  Solar Input connected to Solar Cell Inhibit Switch
- 0805
- LED (BATT CHRG)
- (From) Solar Panel
  Connectors
- *To MCU
- *Power to System
  Specifically, VBATT supplies PDU
- ~ACP left floating
  when unused (pg. 8)
- ~ACP left floating
  when unused (pg. 8)
- ~ACP left floating
  when unused (pg. 8)
- *To MCU
- ~ICL left floating
  when unused (pg. 8)
- *To MCU
- Signal generated from MCU into LTC4012's Pin => *From MCU
  Signal generated from LTC4012's Pin into MCU => *To MCU
- *From MCU
- *use AIML-0805-100K-T for 10 uH (0805)
  *use AIML-0805-150K-T for 15 uH (0805)
- Two 1 uF Cap in Parallel = 2 uF Tot Cap
- (RIN1)
- RC Circuit
- (RSENSE)
- (RIN2)
- BATT_CHRG is supplied by 
  Batteries on PyCubed Battery Board
- BATT_CHRG is supplied by 
  Batteries on PyCubed Battery Board
- BATT_CHRG is supplied by 
  Batteries on PyCubed Battery Board
- BATT_CHRG is supplied by 
  Batteries on PyCubed Battery Board
- BATT_CHRG is supplied by 
  Batteries on PyCubed Battery Board
- 0603
- Battery Charger Controller
- All cap/res are 0603 size unless indicated otherwise.

## Sheet 12 of 12
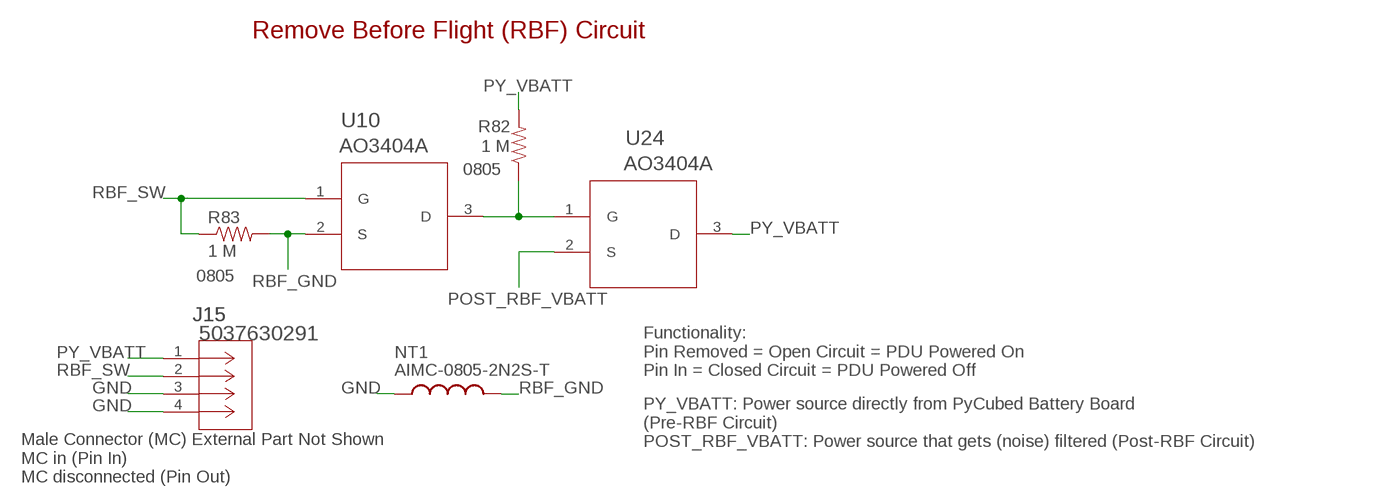
[diagram p11: schematic, sheet 12]

### Parts
J15  5037630291  [CON_5037630291]
NT1  AIMC-0805-2N2S-T  [INDC2012X105N]
R82  1 M  RESISTOR0805-RES  [0805]
R83  1 M  RESISTOR0805-RES  [0805]
U10  AO3404A  [SOT-23-3L_AOS]
U24  AO3404A  [SOT-23-3L_AOS]

### Nets
GND: J15.3 J15.4 NT1.1 ; also sheet 1,2,3,4,5,6,7,8,9,10,11
N$20: R82.1 U10.3(D) U24.1(G)
POST_RBF_VBATT: U24.2(S) ; also sheet 3
PY_VBATT: J15.1 R82.2 U24.3(D) ; also sheet 2
RBF_GND: NT1.2 R83.2 U10.2(S)
RBF_SW: J15.2 R83.1 U10.1(G)

### Notes on the sheet
- Remove Before Flight (RBF) Circuit
- 0805
- 0805
- Functionality:
  Pin Removed = Open Circuit = PDU Powered On
  Pin In = Closed Circuit = PDU Powered Off
- PY_VBATT: Power source directly from PyCubed Battery Board
  (Pre-RBF Circuit)
  POST_RBF_VBATT: Power source that gets (noise) filtered (Post-RBF Circuit)
- Male Connector (MC) External Part Not Shown
  MC in (Pin In)
  MC disconnected (Pin Out)

## Power pins joined to a net without a drawn wire
VBUS: J11.A4(VBUS) J11.A9(VBUS) J11.B4(VBUS) J11.B9(VBUS)
VIN3: U3.6(VIN3) U4.6(VIN3) U5.6(VIN3) U6.6(VIN3) U7.6(VIN3) U9.6(VIN3)

## Library data of the parts
C1-C92 C99 C100 = HSFL_Main_Library:CAP: Capacitor Standard 0603 ceramic capacitor, and 0.1" leaded capacitor.
D1 = charging:CMDSH-3TR: CMDSH Series 30 V 100 mA Surface Mount Schottky Diode - SOD-323; DESCRIPTION: Diode Schottky 30 V 100mA Surface Mount SOD-323; DIGI-KEY_PART_NUMBER: 1514-CMDSH-3TRPBFREECT-ND; MF: Central Semiconductor; MP: CMDSH-3 TR; PACKAGE: SOD-323 Central Semiconductor; PURCHASE-URL: https://pricing.snapeda.com/search/part/CMDSH-3 TR/?ref=eda
D2 = Artemis:1655: Ws2812b 5050 Rgb Led With Integrated Driver Chip Pack Of 10; DESCRIPTION: Ws2812b 5050 Rgb Led With Integrated Driver Chip Pack Of 10; MF: Adafruit; MP: 1655; PACKAGE: Adafruit
D3 D5 = charging:MBR230S1F; COPYRIGHT: Copyright (C) 2021 Ultra Librarian. All rights reserved.; DIGI-KEY_PART_NUMBER_1: MBR230LSFT1GOSTR-ND; DIGI-KEY_PART_NUMBER_2: MBR230LSFT1GOSCT-ND; DIGI-KEY_PART_NUMBER_3: MBR230LSFT1GOSDKR-ND; DIGI-KEY_PART_NUMBER_4: 2156-MBR230LSFT1G-OS-ND; MANUFACTURER_PART_NUMBER: MBR230LSFT1G; MFR_NAME: onsemi
D4 = adafruit:DIODE: Diode SMADIODE - SMA Surface Mount Package 20V 1A Schottky Diode Digikey: 641-1014-6-ND DO-1N4148 - Through Hole Small Current Diode SOD-123 20V 1 A (.5mV Vf) Schottky Diode - Digikey: MBRX120TPMSCT-ND SOD-323 10V 570mA (.38mV Vf, 3ns) Schottky Diode - Digikey: ZLLS410CT-ND SOD-523 30V 30mA Schottky Diode (RB751S-40TE61) - Digikey: RB751S-40TE61CT-ND SOT23-R/W - SOT23 Package (R = Solder Paste/Reflow Ovens, W = Hand-Soldering) BAT54Film 40V 300mA - Digikey: 497-7162-1-ND
D6-D12 = Artemis:PMEG10020ELRX; BUILT_BY: EMA_Cory; COPYRIGHT: Copyright (C) 2018 Accelerated Designs. All rights reserved; DATASHEET: https://assets.nexperia.com/documents/data-sheet/PMEG10020ELR.pdf; MANUFACTURER_PART_NUMBER: PMEG10020ELRX; SOURCELIBRARY: Nexperia_2020-02-26; VENDOR: Nexperia
D13 = HSFL_Main_Library:LED_0805
H1 = HSFL_Main_Library:PC104_WCONN
J1-J6 J12-J17 J19 J22-J25 = Artemis:5037630291; BUILT_BY: Molex_Team; COPYRIGHT: Copyright (C) 2018 Accelerated Designs. All rights reserved; MANUFACTURER_PART_NUMBER: 5037630291; SOURCELIBRARY: Add_to_database_2021-03-17; VENDOR: Molex Connector Corporation
J7-J10 J18 = Artemis:5037630491; BUILT_BY: Molex_Team; COPYRIGHT: Copyright (C) 2018 Accelerated Designs. All rights reserved; MANUFACTURER_PART_NUMBER: 5037630491; SOURCELIBRARY: Add_to_database_2021-03-17; VENDOR: Molex Connector Corporation
J11 = Artemis:UJ31-CH-G1-SMT-TR: Type C, USB 3.1 Gen 2, Right Angle, Surface Mount (SMT) , USB Receptacle Check prices <https://pricing.snapeda.com/parts/UJ31-CH-G1-SMT-TR/CUI%20Devices/view-part?ref=eda>; AVAILABILITY: In Stock; CUI_PURCHASE_URL: https://www.cuidevices.com/product/interconnect/connectors/usb-connectors/uj31-ch-g1-smt-tr?utm_source=snapeda.com&utm_medium=referral&utm_campaign=snapedaBOM; DESCRIPTION: Type C, USB 3.1 Gen 2, 5 A, Right Angle, Surface Mount (SMT) , USB Receptacle; MF: CUI Devices; MP: UJ31-CH-G1-SMT-TR; PACKAGE: None; PRICE: None; PURCHASE-URL: https://pricing.snapeda.com/search/part/UJ31-CH-G1-SMT-TR/?ref=eda
J20 = Artemis:503182-1852: Conn Micro SD Card M 8 POS 1.09mm Solder RA SMD Embossed T/R 0.5A/Contact; DESCRIPTION: 10 (8 + 2) Position Card Connector Secure Digital - microSD™ Surface Mount, Right Angle Gold; DIGI-KEY_PART_NUMBER: WM12834CT-ND; MF: Molex; MP: 5031821852; PACKAGE: None
J27 = Artemis:5037630691; BUILT_BY: EMA_Cory; COPYRIGHT: Copyright (C) 2018 Accelerated Designs. All rights reserved; DATASHEET: https://www.digikey.com/products/en?keywords=503763-0691; MANUFACTURER_PART_NUMBER: 503763-0691; SOURCELIBRARY: Molex_2020-01-22; VENDOR: Molex Connector Corporation
J28 = PDU:68016-202HLF
L1 L3 L6 = Artemis:PA4341.222NLT; COPYRIGHT: Copyright (C) 2021 Ultra Librarian. All rights reserved.; DIGI-KEY_PART_NUMBER_1: 553-3409-2-ND; DIGI-KEY_PART_NUMBER_2: 553-3409-1-ND; DIGI-KEY_PART_NUMBER_3: 553-3409-6-ND; MANUFACTURER_PART_NUMBER: PA4341.222NLT; MFR_NAME: Pulse Electronics Corporation
L2 = charging:AIML-0805-150K-T; COPYRIGHT: Copyright (C) 2021 Ultra Librarian. All rights reserved.; DIGI-KEY_PART_NUMBER_1: 535-11623-1-ND; DIGI-KEY_PART_NUMBER_2: 535-11623-2-ND; DIGI-KEY_PART_NUMBER_3: 535-11623-6-ND; MANUFACTURER_PART_NUMBER: AIML-0805-150K-T; MFR_NAME: Abracon
L4 = Artemis:CBL2012T100M: Power Inductor; Inductor Type:Power; Series:CBL; Inductance:10µH; Inductance Tolerance:± 20%; DC Resistance Max:1.3ohm; DC Current Rating:205mA; Package/Case:0805; Current Rating:205mA; Leaded Process Compatible:Yes ;RoHS Compliant: Yes; DESCRIPTION: 10µH Unshielded Wirewound Inductor 370mA 1.3Ohm Max 0805 (2012 Metric); DIGI-KEY_PART_NUMBER: 587-1632-1-ND; MF: Taiyo Yuden; MP: CBL2012T100M; PACKAGE: 2012 Taiyo Yuden
L5 = HSFL_Main_Library:7443551600
M1-M4 = HSFL_Main_Library:BSZ100N06LS3
NT1 = PDUv2:AIMC-0805-2N2S-T: 2.2nH Unshielded Multilayer Inductor 600mA 100mOhm Max 0805 (2012 Metric); DESCRIPTION: IND 2.2nH 0.3A 100mΩ; DIGI-KEY_PART_NUMBER: 535-11562-1-ND; MF: Abracon; MP: AIMC-0805-2N2S-T; PACKAGE: 2012 Bourns
R1-R97 = HSFL_Main_Library:RESISTOR: Resistor Basic schematic elements and footprints for 0603, 1206, and PTH resistors.
U1 U2 = Artemis:DRV8847PWPR: None Check prices <https://pricing.snapeda.com/parts/DRV8847PWPR/Texas%20Instruments/view-part?ref=eda>; AVAILABILITY: Warning; DESCRIPTION: 18-V, 2-A dual H-bridge motor driver with current regulation & independent half-bridge control 16-HTSSOP -40 to 125; MF: Texas Instruments; MP: DRV8847PWPR; PACKAGE: HTSSOP-16 Texas Instruments; PRICE: None; PURCHASE-URL: https://pricing.snapeda.com/search/part/DRV8847PWPR/?ref=eda
U3-U7 U9 = Artemis:LTC1477CS8: LT-LTC1477-S8-8; CIIVA_IDS: 1432281; COMPONENT_LINK_1_DESCRIPTION: Manufacturer URL; COMPONENT_LINK_1_URL: http://www.linear.com/; COMPONENT_LINK_3_DESCRIPTION: Package Specification; COMPONENT_LINK_3_URL: http://cds.linear.com/docs/en/packaging/05081610_G_SO8.pdf; DATASHEET: http://cds.linear.com/docs/en/datasheet/lt1477.pdf; FOOTPRINT_VARIANT_NAME_0: Level C; FOOTPRINT_VARIANT_NAME_1: Level B; FOOTPRINT_VARIANT_NAME_2: Level A; IMPORTED: yes; IMPORTED_FROM: vault; IMPORT_TS: 1521843574; MF: Linear Technology; MOUNTING_TECHNOLOGY: Surface Mount; MPN: LTC1477CS8; PACKAGE: S8-8; PACKAGE_DESCRIPTION: 8-Pin Plastic Small Outline (Narrow .150 Inch), Body 4.9 x 3.9 mm, Pitch 1.27 mm; PACKAGE_VERSION: Rev. G, 03/2012; PREFIX: U; RELEASE_DATE: 1377817843; ROHS: No; VAULT_GUID: 635B2D7C-EC07-409E-A57F-666E02CD64AC; VAULT_REVISION: 6B8B57C2-2CB3-4970-A31A-1EB58B636423
U8 U21 U22 = HSFL_Main_Library:LT8609A
U10 U24 = Artemis:AO3404A; BUILT_BY: EMA_Molly; COPYRIGHT: Copyright (C) 2018 Accelerated Designs. All rights reserved; MANUFACTURER_PART_NUMBER: AO3400A; SOURCELIBRARY: Alpha_and_Omega_2019-12-17; VENDOR: Alpha and Omega
U11 U12 = Artemis:IRLML2803PBFCT-ND; BUILT_BY: EMA_UL_Team; COPYRIGHT: Copyright (C) 2018 Accelerated Designs. All rights reserved; MANUFACTURER_PART_NUMBER: IRLML2803PBFCT-ND; SOURCELIBRARY: Infineon_2019-12-20; VENDOR: Infineon
U13 = Artemis:LT8390EFE#PBF: DC/DC Cntrlr Single-OUT Step Down/Step Up 630kHz Automotive 28-Pin TSSOP EP Tube Check prices <https://pricing.snapeda.com/parts/LT8390EFE%23PBF/Analog%20Devices/view-part?ref=eda>; AVAILABILITY: No availability data; DESCRIPTION: DC/DC Cntrlr Single-OUT Step Down/Step Up 630kHz Automotive 28-Pin TSSOP EP Tube; MF: Analog Devices; MP: LT8390EFE#PBF; PACKAGE: TSSOP -28 Analog Devices; PRICE: None
U14 = Artemis:ATSAME51N19A-AF; BUILT_BY: EMA_Molly; COPYRIGHT: Copyright (C) 2018 Accelerated Designs. All rights reserved; MANUFACTURER_PART_NUMBER: ATSAME51N19A-AF; SOURCELIBRARY: Microchip_2019-08-23_25; VENDOR: Microchip
U15 U30-U33 = Artemis:INA219BIDR: Check prices <https://pricing.snapeda.com/parts/INA219BIDR/Texas%20Instruments/view-part?ref=eda>; AVAILABILITY: In Stock; DESCRIPTION: 26V, 12-bit, i2c output current/voltage/power monitor 8-SOIC -40 to 125; MF: Texas Instruments; MP: INA219BIDR; PACKAGE: SOIC-8 Texas Instruments; PRICE: None; PURCHASE-URL: https://pricing.snapeda.com/search/part/INA219BIDR/?ref=eda
U16 = Artemis:MIC2514YM5-TR; COPYRIGHT: Copyright (C) 2021 Ultra Librarian. All rights reserved.; DIGI-KEY_PART_NUMBER_1: 576-1085-1-ND; DIGI-KEY_PART_NUMBER_2: 576-1085-2-ND; DIGI-KEY_PART_NUMBER_3: 576-1085-2-NDL; DIGI-KEY_PART_NUMBER_4: 576-1085-6-ND; MANUFACTURER_PART_NUMBER: MIC2514YM5-TR; MFR_NAME: Microchip
U17 = Artemis:MAX16998AAUA+T; BUILT_BY: EMA_UL_Team; MANUFACTURER_PART_NUMBER: MAX16998AAUA+T; REVISION: 2; SOURCELIBRARY: Maxim_2014-04-30_1; VENDOR: Maxim Integrated Products
U18 = Artemis:TMP36FSZ; COPYRIGHT: Copyright (C) 2021 Ultra Librarian. All rights reserved.; MANUFACTURER_PART_NUMBER: TMP36FSZ; MFR_NAME: Analog Devices Inc
U20 = charging:LTC4012IUFPBF: High Efficiency,Multi-Chemistry Battery Charger with PowerPath Control Check prices <https://pricing.snapeda.com/parts/LTC4012IUF%23PBF/Analog%20Devices/view-part?ref=eda>; AVAILABILITY: In Stock; DESCRIPTION: Charger IC Multi-Chemistry 20-QFN (4x4); MF: Analog Devices; MP: LTC4012IUF#PBF; PACKAGE: QFN -20 Analog Devices; PRICE: None; PURCHASE-URL: https://pricing.snapeda.com/search/part/LTC4012IUF#PBF/?ref=eda
U23 = Artemis:BC848ALT1G; BUILT_BY: EMA_Jessica; COPYRIGHT: Copyright (C) 2018 Accelerated Designs. All rights reserved; MANUFACTURER_PART_NUMBER: BC848ALT1G; SOURCELIBRARY: OnSemi_2021-05-28_3; VENDOR: ON Semiconductor
U25 = Artemis:SI4835DDY-T1-GE3; COPYRIGHT: Copyright (C) 2021 Ultra Librarian. All rights reserved.; MANUFACTURER_PART_NUMBER: SI4835DDY-T1-GE3; MFR_NAME: Vishay
U26 U27 = Artemis:SI3493DDV-T1-GE3; COPYRIGHT: Copyright (C) 2021 Ultra Librarian. All rights reserved.; DIGI-KEY_PART_NUMBER_1: SI3493DDV-T1-GE3TR-ND; DIGI-KEY_PART_NUMBER_2: SI3493DDV-T1-GE3CT-ND; DIGI-KEY_PART_NUMBER_3: SI3493DDV-T1-GE3DKR-ND; MANUFACTURER_PART_NUMBER: SI3493DDV-T1-GE3; MFR_NAME: Vishay
U28 = charging:SI4431BDY-T1-E3; COPYRIGHT: Copyright (C) 2021 Ultra Librarian. All rights reserved.; DIGI-KEY_PART_NUMBER_1: SI4431BDY-T1-E3CT-ND; DIGI-KEY_PART_NUMBER_2: SI4431BDY-T1-E3DKR-ND; DIGI-KEY_PART_NUMBER_3: SI4431BDY-T1-E3TR-ND; MANUFACTURER_PART_NUMBER: SI4431BDY-T1-E3; MFR_NAME: Vishay
U29 = charging:AO4818B; COPYRIGHT: Copyright (C) 2021 Ultra Librarian. All rights reserved.; DIGI-KEY_PART_NUMBER_1: SI4816BDY-T1-E3TR-ND; DIGI-KEY_PART_NUMBER_2: SI4816BDY-T1-E3CT-ND; DIGI-KEY_PART_NUMBER_3: SI4816BDY-T1-E3DKR-ND; MANUFACTURER_PART_NUMBER: SI4816BDY-T1-E3; MFR_NAME: Vishay
U35 = PDU:LND01K1-G; COPYRIGHT: Copyright (C) 2022 Ultra Librarian. All rights reserved.; DIGI-KEY_PART_NUMBER_1: LND01K1-GCT-ND; DIGI-KEY_PART_NUMBER_2: LND01K1-GDKR-ND; DIGI-KEY_PART_NUMBER_3: LND01K1-GTR-ND; MANUFACTURER_PART_NUMBER: LND01K1-G; MFR_NAME: Microchip
Y1 = Artemis:ABS07-32.768KHZ-T: ABS07 Series 32.768 kHz ±20 ppm 12.5 pF -40 to +85 °C SMT Low Profile Crystal; DESCRIPTION: 32.768kHz ±20ppm Crystal 12.5pF 70 kOhms 2-SMD, No Lead; DIGI-KEY_PART_NUMBER: 535-9542-1-ND; MF: Abracon; MP: ABS07-32.768KHZ-T; PACKAGE: SMD-2 Abracon LLC; PURCHASE-URL: https://pricing.snapeda.com/search/part/ABS07-32.768KHZ-T/?ref=eda